# EAGLE design RF-OUT-001 (EAGLE 9.6.2)
DOCNUM: RF-OUT-001; DWBY: Lewis Russell; DWDATE: 3/2/21; DWINIT: LR; REV: 001; TITLE: RF Amplifier Output Filter

## Sheet 1 of 5: System Architecture
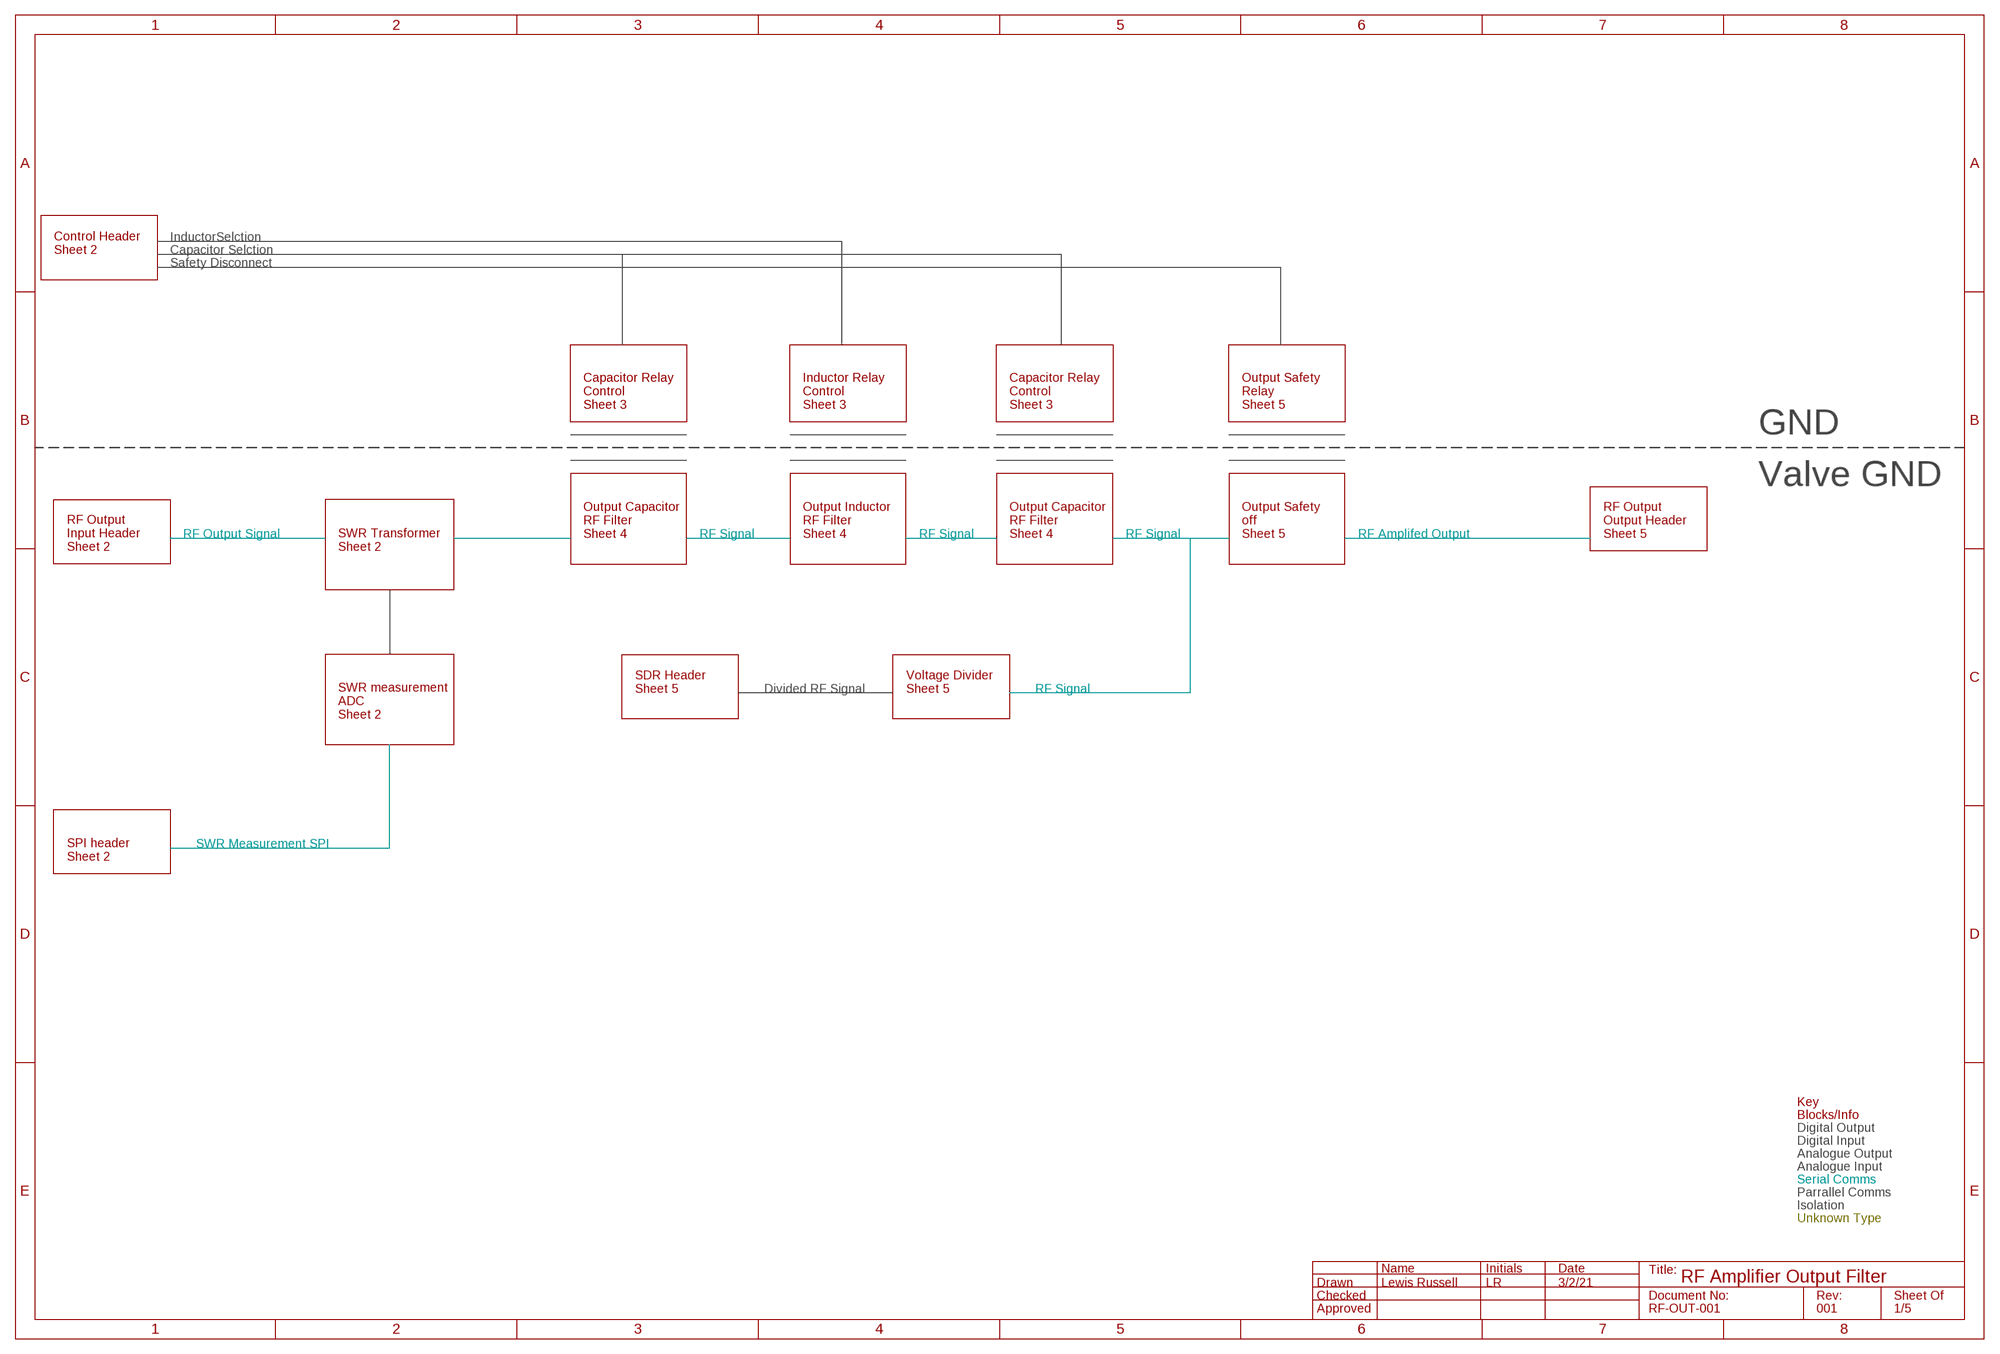
[diagram p0: schematic, sheet 1]

### Notes on the sheet
- InductorSelction
- Control Header
  Sheet 2
- Capacitor Selction
- Safety Disconnect
- Capacitor Relay
  Control
  Sheet 3
- Inductor Relay
  Control
  Sheet 3
- Capacitor Relay
  Control
  Sheet 3
- Output Safety
  Relay
  Sheet 5
- GND
- Valve GND
- RF Output Signal
- Output Capacitor
  RF Filter
  Sheet 4
- RF Signal
- Output Inductor
  RF Filter
  Sheet 4
- RF Signal
- Output Capacitor
  RF Filter
  Sheet 4
- RF Signal
- Output Safety
  off
  Sheet 5
- RF Amplifed Output
- RF Output
  Output Header
  Sheet 5
- RF Output
  Input Header
  Sheet 2
- SWR Transformer
  Sheet 2
- SDR Header
  Sheet 5
- Divided RF Signal
- Voltage Divider
  Sheet 5
- RF Signal
- SWR measurement
  ADC
  Sheet 2
- SWR Measurement SPI
- SPI header
  Sheet 2
- Key
- Blocks/Info
- Digital Output
- Digital Input
- Analogue Output
- Analogue Input
- Serial Comms
- Parrallel Comms
- Isolation
- Unknown Type

## Sheet 2 of 5: SWR Measurement
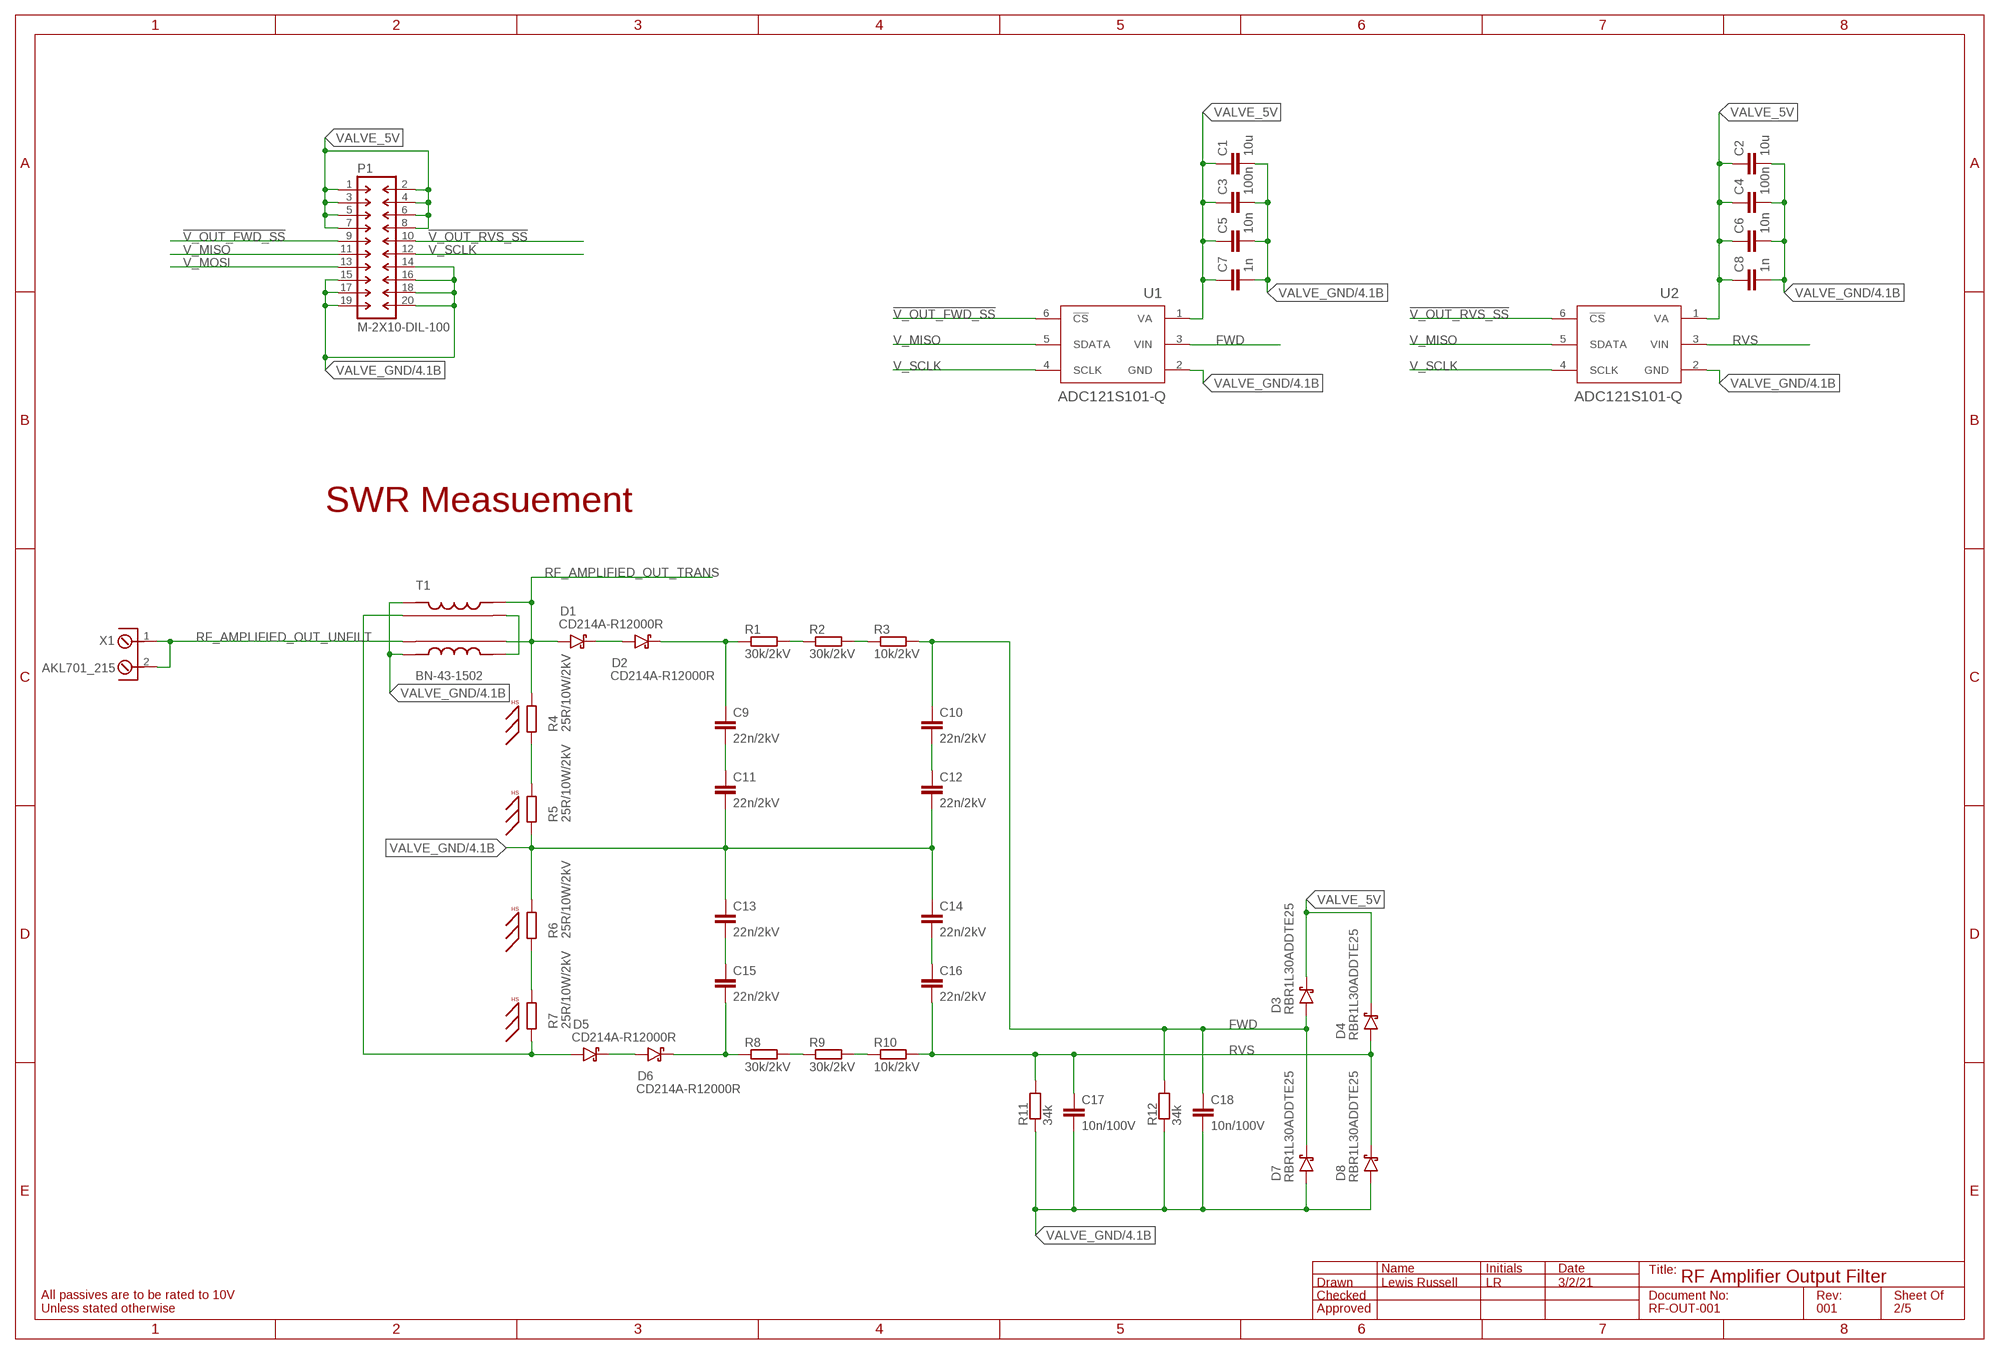
[diagram p1: schematic, sheet 2]

### Parts
C1  10u  C-EUC0805  [C0805]
C2  10u  C-EUC0805  [C0805]
C3  100n  C-EUC0603  [C0603]
C4  100n  C-EUC0603  [C0603]
C5  10n  C-EUC0603  [C0603]
C6  10n  C-EUC0603  [C0603]
C7  1n  C-EUC0603  [C0603]
C8  1n  C-EUC0603  [C0603]
C9  22n/2kV  C-EUC2220K  [C2220K]
C10  22n/2kV  C-EUC2220K  [C2220K]
C11  22n/2kV  C-EUC2220K  [C2220K]
C12  22n/2kV  C-EUC2220K  [C2220K]
C13  22n/2kV  C-EUC2220K  [C2220K]
C14  22n/2kV  C-EUC2220K  [C2220K]
C15  22n/2kV  C-EUC2220K  [C2220K]
C16  22n/2kV  C-EUC2220K  [C2220K]
C17  10n/100V  C-EUC0603  [C0603]
C18  10n/100V  C-EUC0603  [C0603]
D1  CD214A-R12000R  SCHOTTKY_DIODESMB  [SMB/DO-214AA]
D2  CD214A-R12000R  SCHOTTKY_DIODESMB  [SMB/DO-214AA]
D3  RBR1L30ADDTE25  SCHOTTKY_DIODESMA  [SMA/DO-214AC]
D4  RBR1L30ADDTE25  SCHOTTKY_DIODESMA  [SMA/DO-214AC]
D5  CD214A-R12000R  SCHOTTKY_DIODESMB  [SMB/DO-214AA]
D6  CD214A-R12000R  SCHOTTKY_DIODESMB  [SMB/DO-214AA]
D7  RBR1L30ADDTE25  SCHOTTKY_DIODESMA  [SMA/DO-214AC]
D8  RBR1L30ADDTE25  SCHOTTKY_DIODESMA  [SMA/DO-214AC]
P1  M-2X10-DIL-100  [DIL-100-2X10]
R1  30k/2kV  R-EU_0309/10  [0309/10]
R2  30k/2kV  R-EU_0309/10  [0309/10]
R3  10k/2kV  R-EU_0309/10  [0309/10]
R4  25R/10W/2kV  R-EU_W_HS_TO-220-WV-T220-101E  [TO220ACS_WITH_WV-T220-101E]
R5  25R/10W/2kV  R-EU_W_HS_TO-220-WV-T220-101E  [TO220ACS_WITH_WV-T220-101E]
R6  25R/10W/2kV  R-EU_W_HS_TO-220-WV-T220-101E  [TO220ACS_WITH_WV-T220-101E]
R7  25R/10W/2kV  R-EU_W_HS_TO-220-WV-T220-101E  [TO220ACS_WITH_WV-T220-101E]
R8  30k/2kV  R-EU_0309/10  [0309/10]
R9  30k/2kV  R-EU_0309/10  [0309/10]
R10  10k/2kV  R-EU_0309/10  [0309/10]
R11  34k  R-EUR0603  [R0603]
R12  34k  R-EUR0603  [R0603]
T1  BN-43-1502  [BN-43-1502]
U1  ADC121S101-Q  [SOT23-6]
U2  ADC121S101-Q  [SOT23-6]
X1  AKL701_215  [AKL701_2_15]

### Nets
!V_OUT_FWD_SS [HV_SIG]: P1.9 U1.6(!CS)
!V_OUT_RVS_SS [HV_SIG]: P1.10 U2.6(!CS)
FWD [HV_SIG]: C10.1 C18.1 D3.A(ANODE) D7.C(CATHODE) R3.2 R12.2 U1.3(VIN)
N$196 [HV_RF]: T1.L2-2(C2-2) T1.T1-2(L1-2)
N$198 [HV DIV]: R4.1 R5.2
N$199 [HV_RDIV]: R6.1 R7.2
N$200 [HV_SIG]: C9.2 C11.1
N$201 [HV DIV]: D1.C(CATHODE) D2.A(ANODE)
N$203 [HV_SIG]: C9.1 D2.C(CATHODE) R1.1
N$204 [HV_SIG]: R1.2 R2.1
N$205 [HV_SIG]: C10.2 C12.1
N$207 [HV_SIG]: R2.2 R3.1
N$209 [HV_SIG]: C13.2 C15.1
N$210 [HV DIV]: D5.C(CATHODE) D6.A(ANODE)
N$211 [HV_SIG]: C15.2 D6.C(CATHODE) R8.1
N$212 [HV_SIG]: C14.2 C16.1
N$214 [HV_SIG]: R8.2 R9.1
N$215 [HV_SIG]: R9.2 R10.1
N$216 [HV_RF]: D5.A(ANODE) R7.1 T1.T1-1(L1-1)
RF_AMPLIFIED_OUT_TRANS [HV_RF]: D1.A(ANODE) R4.2 T1.L1-2(C1-2) T1.T2-2(L2-2) ; also sheet 4
RF_AMPLIFIED_OUT_UNFILT [HV_RF]: T1.T2-1(L2-1) X1.1 X1.2
RVS [HV_SIG]: C16.2 C17.1 D4.A(ANODE) D8.C(CATHODE) R10.2 R11.2 U2.3(VIN)
V_MISO [HV_SIG]: P1.11 U1.5(SDATA) U2.5(SDATA)
V_MOSI [HV_SIG]: P1.13
V_SCLK [HV_SIG]: P1.12 U1.4(SCLK) U2.4(SCLK)
VALVE_5V [HV_GND]: C1.1 C2.1 C3.1 C4.1 C5.1 C6.1 C7.1 C8.1 D3.C(CATHODE) D4.C(CATHODE) P1.1 P1.2 P1.3 P1.4 P1.5 P1.6 P1.7 P1.8 U1.1(VA) U2.1(VA)
VALVE_GND [HV_GND]: C1.2 C2.2 C3.2 C4.2 C5.2 C6.2 C7.2 C8.2 C11.2 C12.2 C13.1 C14.1 C17.2 C18.2 D7.A(ANODE) D8.A(ANODE) P1.14 P1.15 P1.16 P1.17 P1.18 P1.19 P1.20 R5.1 R6.2 R11.1 R12.1 T1.L1-1(C1-1) T1.L2-1(C2-1) U1.2(GND) U2.2(GND) ; also sheet 4,5

### Notes on the sheet
- SWR Measuement
- All passives are to be rated to 10V
  Unless stated otherwise

## Sheet 3 of 5: ATU Relay Control
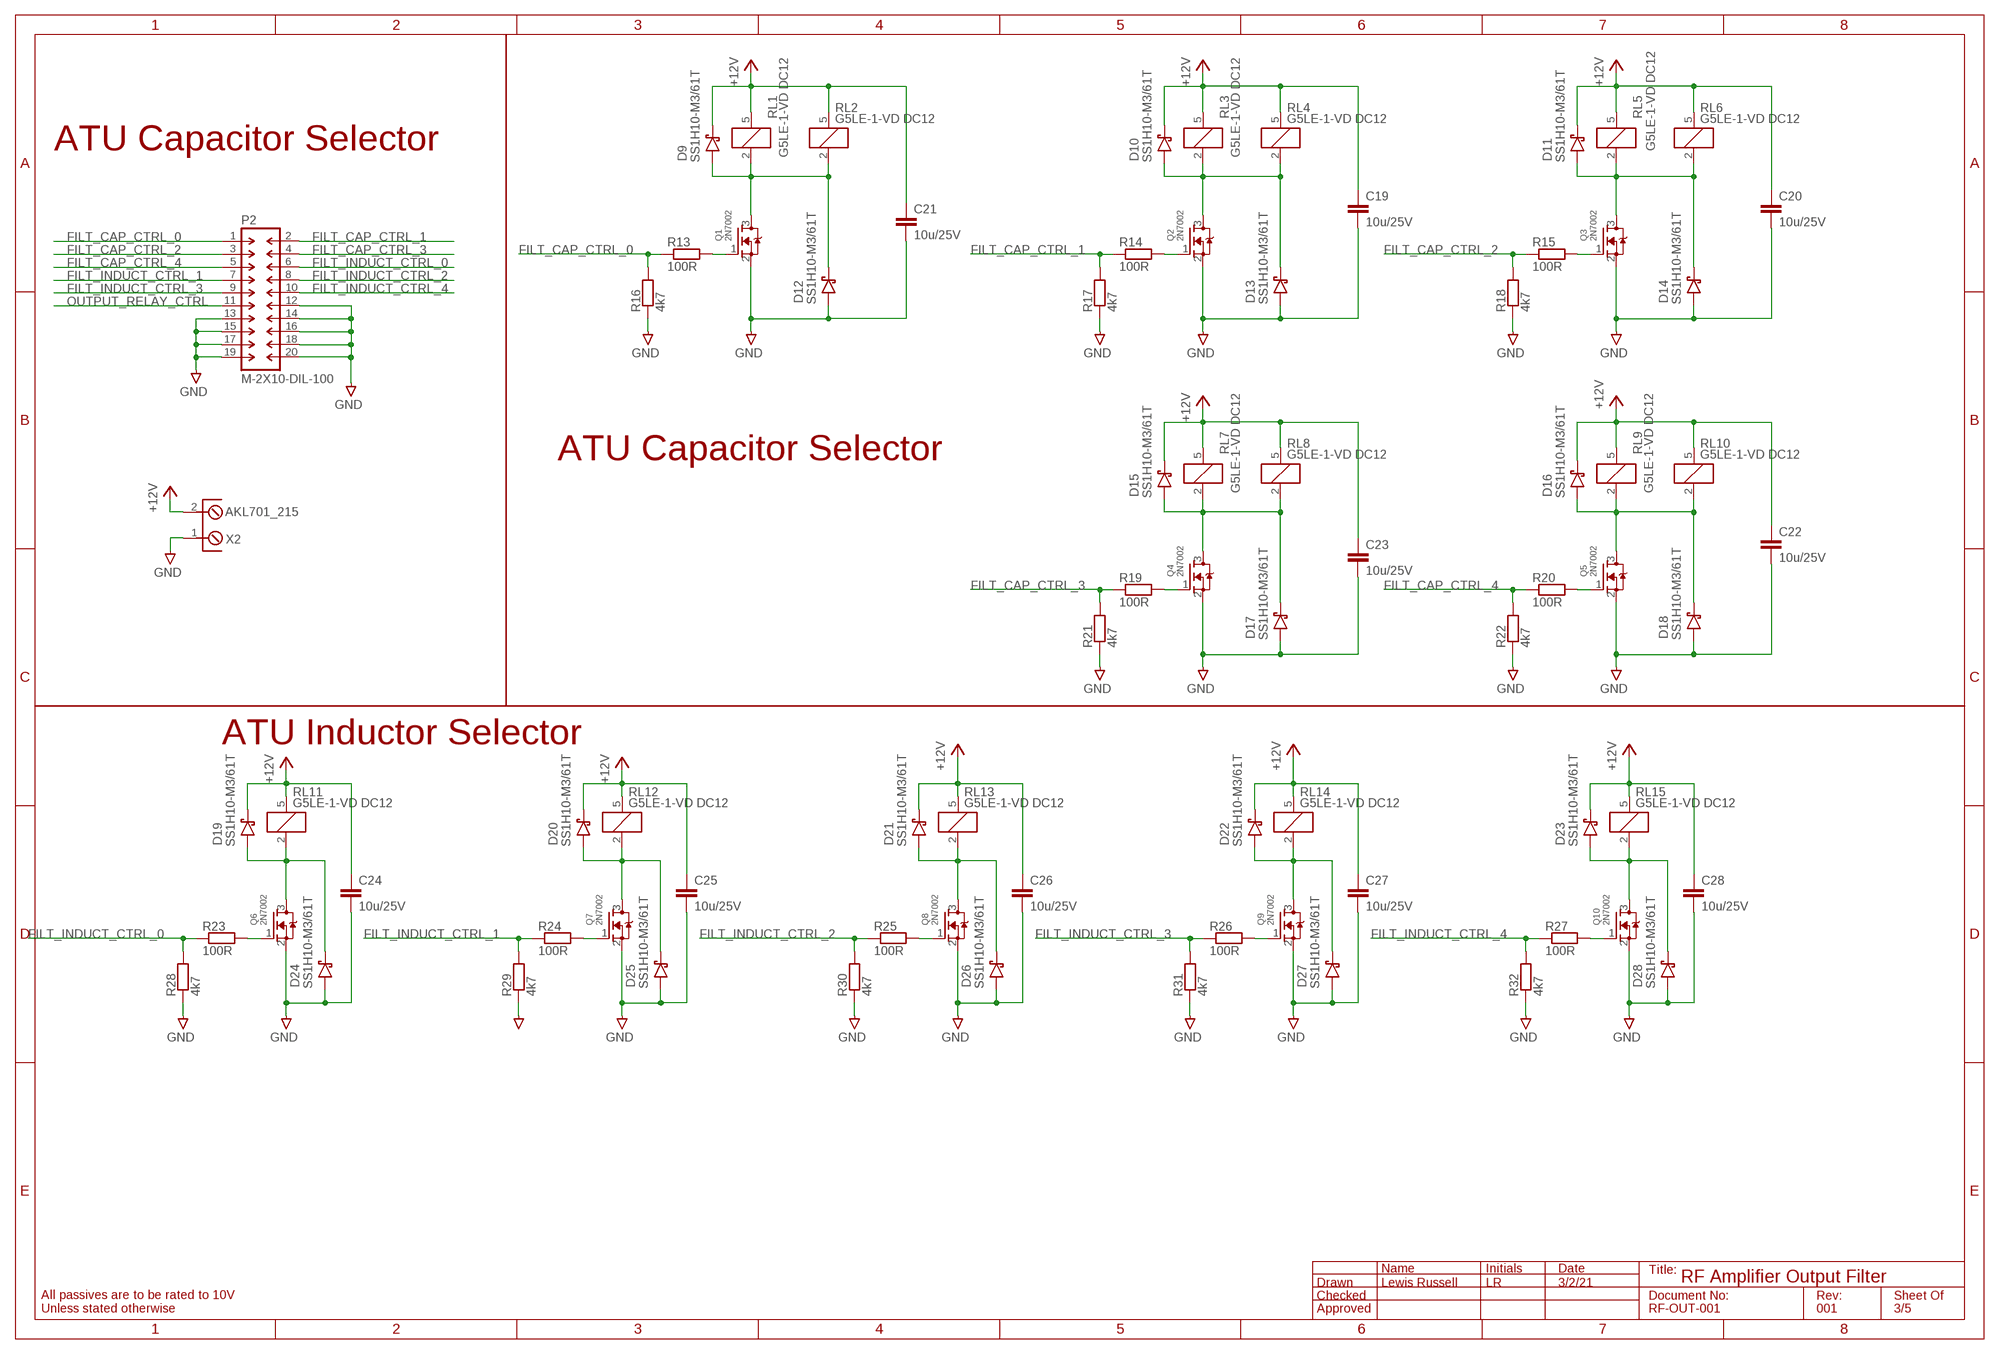
[diagram p2: schematic, sheet 3]

### Parts
C19  10u/25V  C-EUC0805  [C0805]
C20  10u/25V  C-EUC0805  [C0805]
C21  10u/25V  C-EUC0805  [C0805]
C22  10u/25V  C-EUC0805  [C0805]
C23  10u/25V  C-EUC0805  [C0805]
C24  10u/25V  C-EUC0805  [C0805]
C25  10u/25V  C-EUC0805  [C0805]
C26  10u/25V  C-EUC0805  [C0805]
C27  10u/25V  C-EUC0805  [C0805]
C28  10u/25V  C-EUC0805  [C0805]
D9  SS1H10-M3/61T  SCHOTTKY_DIODESMA  [SMA/DO-214AC]
D10  SS1H10-M3/61T  SCHOTTKY_DIODESMA  [SMA/DO-214AC]
D11  SS1H10-M3/61T  SCHOTTKY_DIODESMA  [SMA/DO-214AC]
D12  SS1H10-M3/61T  SCHOTTKY_DIODESMA  [SMA/DO-214AC]
D13  SS1H10-M3/61T  SCHOTTKY_DIODESMA  [SMA/DO-214AC]
D14  SS1H10-M3/61T  SCHOTTKY_DIODESMA  [SMA/DO-214AC]
D15  SS1H10-M3/61T  SCHOTTKY_DIODESMA  [SMA/DO-214AC]
D16  SS1H10-M3/61T  SCHOTTKY_DIODESMA  [SMA/DO-214AC]
D17  SS1H10-M3/61T  SCHOTTKY_DIODESMA  [SMA/DO-214AC]
D18  SS1H10-M3/61T  SCHOTTKY_DIODESMA  [SMA/DO-214AC]
D19  SS1H10-M3/61T  SCHOTTKY_DIODESMA  [SMA/DO-214AC]
D20  SS1H10-M3/61T  SCHOTTKY_DIODESMA  [SMA/DO-214AC]
D21  SS1H10-M3/61T  SCHOTTKY_DIODESMA  [SMA/DO-214AC]
D22  SS1H10-M3/61T  SCHOTTKY_DIODESMA  [SMA/DO-214AC]
D23  SS1H10-M3/61T  SCHOTTKY_DIODESMA  [SMA/DO-214AC]
D24  SS1H10-M3/61T  SCHOTTKY_DIODESMA  [SMA/DO-214AC]
D25  SS1H10-M3/61T  SCHOTTKY_DIODESMA  [SMA/DO-214AC]
D26  SS1H10-M3/61T  SCHOTTKY_DIODESMA  [SMA/DO-214AC]
D27  SS1H10-M3/61T  SCHOTTKY_DIODESMA  [SMA/DO-214AC]
D28  SS1H10-M3/61T  SCHOTTKY_DIODESMA  [SMA/DO-214AC]
P2  M-2X10-DIL-100  [DIL-100-2X10]
Q1  2N7002  MOSFET-NREFLOW  [SOT23]
Q2  2N7002  MOSFET-NREFLOW  [SOT23]
Q3  2N7002  MOSFET-NREFLOW  [SOT23]
Q4  2N7002  MOSFET-NREFLOW  [SOT23]
Q5  2N7002  MOSFET-NREFLOW  [SOT23]
Q6  2N7002  MOSFET-NREFLOW  [SOT23]
Q7  2N7002  MOSFET-NREFLOW  [SOT23]
Q8  2N7002  MOSFET-NREFLOW  [SOT23]
Q9  2N7002  MOSFET-NREFLOW  [SOT23]
Q10  2N7002  MOSFET-NREFLOW  [SOT23]
R13  100R  R-EUR0603  [R0603]
R14  100R  R-EUR0603  [R0603]
R15  100R  R-EUR0603  [R0603]
R16  4k7  R-EUR0603  [R0603]
R17  4k7  R-EUR0603  [R0603]
R18  4k7  R-EUR0603  [R0603]
R19  100R  R-EUR0603  [R0603]
R20  100R  R-EUR0603  [R0603]
R21  4k7  R-EUR0603  [R0603]
R22  4k7  R-EUR0603  [R0603]
R23  100R  R-EUR0603  [R0603]
R24  100R  R-EUR0603  [R0603]
R25  100R  R-EUR0603  [R0603]
R26  100R  R-EUR0603  [R0603]
R27  100R  R-EUR0603  [R0603]
R28  4k7  R-EUR0603  [R0603]
R29  4k7  R-EUR0603  [R0603]
R30  4k7  R-EUR0603  [R0603]
R31  4k7  R-EUR0603  [R0603]
R32  4k7  R-EUR0603  [R0603]
RL1  G5LE-1-VD DC12  G5LE-E  [SPDT]
RL2  G5LE-1-VD DC12  G5LE-E  [SPDT]
RL3  G5LE-1-VD DC12  G5LE-E  [SPDT]
RL4  G5LE-1-VD DC12  G5LE-E  [SPDT]
RL5  G5LE-1-VD DC12  G5LE-E  [SPDT]
RL6  G5LE-1-VD DC12  G5LE-E  [SPDT]
RL7  G5LE-1-VD DC12  G5LE-E  [SPDT]
RL8  G5LE-1-VD DC12  G5LE-E  [SPDT]
RL9  G5LE-1-VD DC12  G5LE-E  [SPDT]
RL10  G5LE-1-VD DC12  G5LE-E  [SPDT]
RL11  G5LE-1-VD DC12  G5LE-E  [SPDT]
RL12  G5LE-1-VD DC12  G5LE-E  [SPDT]
RL13  G5LE-1-VD DC12  G5LE-E  [SPDT]
RL14  G5LE-1-VD DC12  G5LE-E  [SPDT]
RL15  G5LE-1-VD DC12  G5LE-E  [SPDT]
X2  AKL701_215  [AKL701_2_15]

### Nets
+12V [GND Signal]: C19.1 C20.1 C21.1 C22.1 C23.1 C24.1 C25.1 C26.1 C27.1 C28.1 D9.C(CATHODE) D10.C(CATHODE) D11.C(CATHODE) D15.C(CATHODE) D16.C(CATHODE) D19.C(CATHODE) D20.C(CATHODE) D21.C(CATHODE) D22.C(CATHODE) D23.C(CATHODE) RL1.5 RL2.5 RL3.5 RL4.5 RL5.5 RL6.5 RL7.5 RL8.5 RL9.5 RL10.5 RL11.5 RL12.5 RL13.5 RL14.5 RL15.5 X2.2 ; also sheet 5
FILT_CAP_CTRL_0 [GND Signal]: P2.1 R13.1 R16.2
FILT_CAP_CTRL_1 [GND Signal]: P2.2 R14.1 R17.2
FILT_CAP_CTRL_2 [GND Signal]: P2.3 R15.1 R18.2
FILT_CAP_CTRL_3 [GND Signal]: P2.4 R19.1 R21.2
FILT_CAP_CTRL_4 [GND Signal]: P2.5 R20.1 R22.2
FILT_INDUCT_CTRL_0 [GND Signal]: P2.6 R23.1 R28.2
FILT_INDUCT_CTRL_1 [GND Signal]: P2.7 R24.1 R29.2
FILT_INDUCT_CTRL_2 [GND Signal]: P2.8 R25.1 R30.2
FILT_INDUCT_CTRL_3 [GND Signal]: P2.9 R26.1 R31.2
FILT_INDUCT_CTRL_4 [GND Signal]: P2.10 R27.1 R32.2
GND [GND Signal]: C19.2 C20.2 C21.2 C22.2 C23.2 C24.2 C25.2 C26.2 C27.2 C28.2 D12.A(ANODE) D13.A(ANODE) D14.A(ANODE) D17.A(ANODE) D18.A(ANODE) D24.A(ANODE) D25.A(ANODE) D26.A(ANODE) D27.A(ANODE) D28.A(ANODE) P2.12 P2.13 P2.14 P2.15 P2.16 P2.17 P2.18 P2.19 P2.20 Q1.2(S) Q2.2(S) Q3.2(S) Q4.2(S) Q5.2(S) Q6.2(S) Q7.2(S) Q8.2(S) Q9.2(S) Q10.2(S) R16.1 R17.1 R18.1 R21.1 R22.1 R28.1 R29.1 R30.1 R31.1 R32.1 X2.1 ; also sheet 5
N$150 [GND Signal]: D9.A(ANODE) D12.C(CATHODE) Q1.3(D) RL1.2 RL2.2
N$162 [GND Signal]: Q1.1(G) R13.2
N$163 [GND Signal]: D10.A(ANODE) D13.C(CATHODE) Q2.3(D) RL3.2 RL4.2
N$175 [GND Signal]: Q2.1(G) R14.2
N$176 [GND Signal]: D11.A(ANODE) D14.C(CATHODE) Q3.3(D) RL5.2 RL6.2
N$301 [GND Signal]: Q3.1(G) R15.2
N$303 [GND Signal]: D15.A(ANODE) D17.C(CATHODE) Q4.3(D) RL7.2 RL8.2
N$305 [GND Signal]: Q4.1(G) R19.2
N$306 [GND Signal]: D16.A(ANODE) D18.C(CATHODE) Q5.3(D) RL9.2 RL10.2
N$307 [GND Signal]: Q5.1(G) R20.2
N$312 [GND Signal]: D19.A(ANODE) D24.C(CATHODE) Q6.3(D) RL11.2
N$314 [GND Signal]: Q6.1(G) R23.2
N$315 [GND Signal]: D20.A(ANODE) D25.C(CATHODE) Q7.3(D) RL12.2
N$316 [GND Signal]: Q7.1(G) R24.2
N$317 [GND Signal]: D21.A(ANODE) D26.C(CATHODE) Q8.3(D) RL13.2
N$318 [GND Signal]: Q8.1(G) R25.2
N$323 [GND Signal]: D22.A(ANODE) D27.C(CATHODE) Q9.3(D) RL14.2
N$324 [GND Signal]: Q9.1(G) R26.2
N$325 [GND Signal]: D23.A(ANODE) D28.C(CATHODE) Q10.3(D) RL15.2
N$326 [GND Signal]: Q10.1(G) R27.2
OUTPUT_RELAY_CTRL [GND Signal]: P2.11 ; also sheet 5

### Notes on the sheet
- ATU Capacitor Selector
- ATU Capacitor Selector
- ATU Inductor Selector
- All passives are to be rated to 10V
  Unless stated otherwise

## Sheet 4 of 5: ATU LC Filter
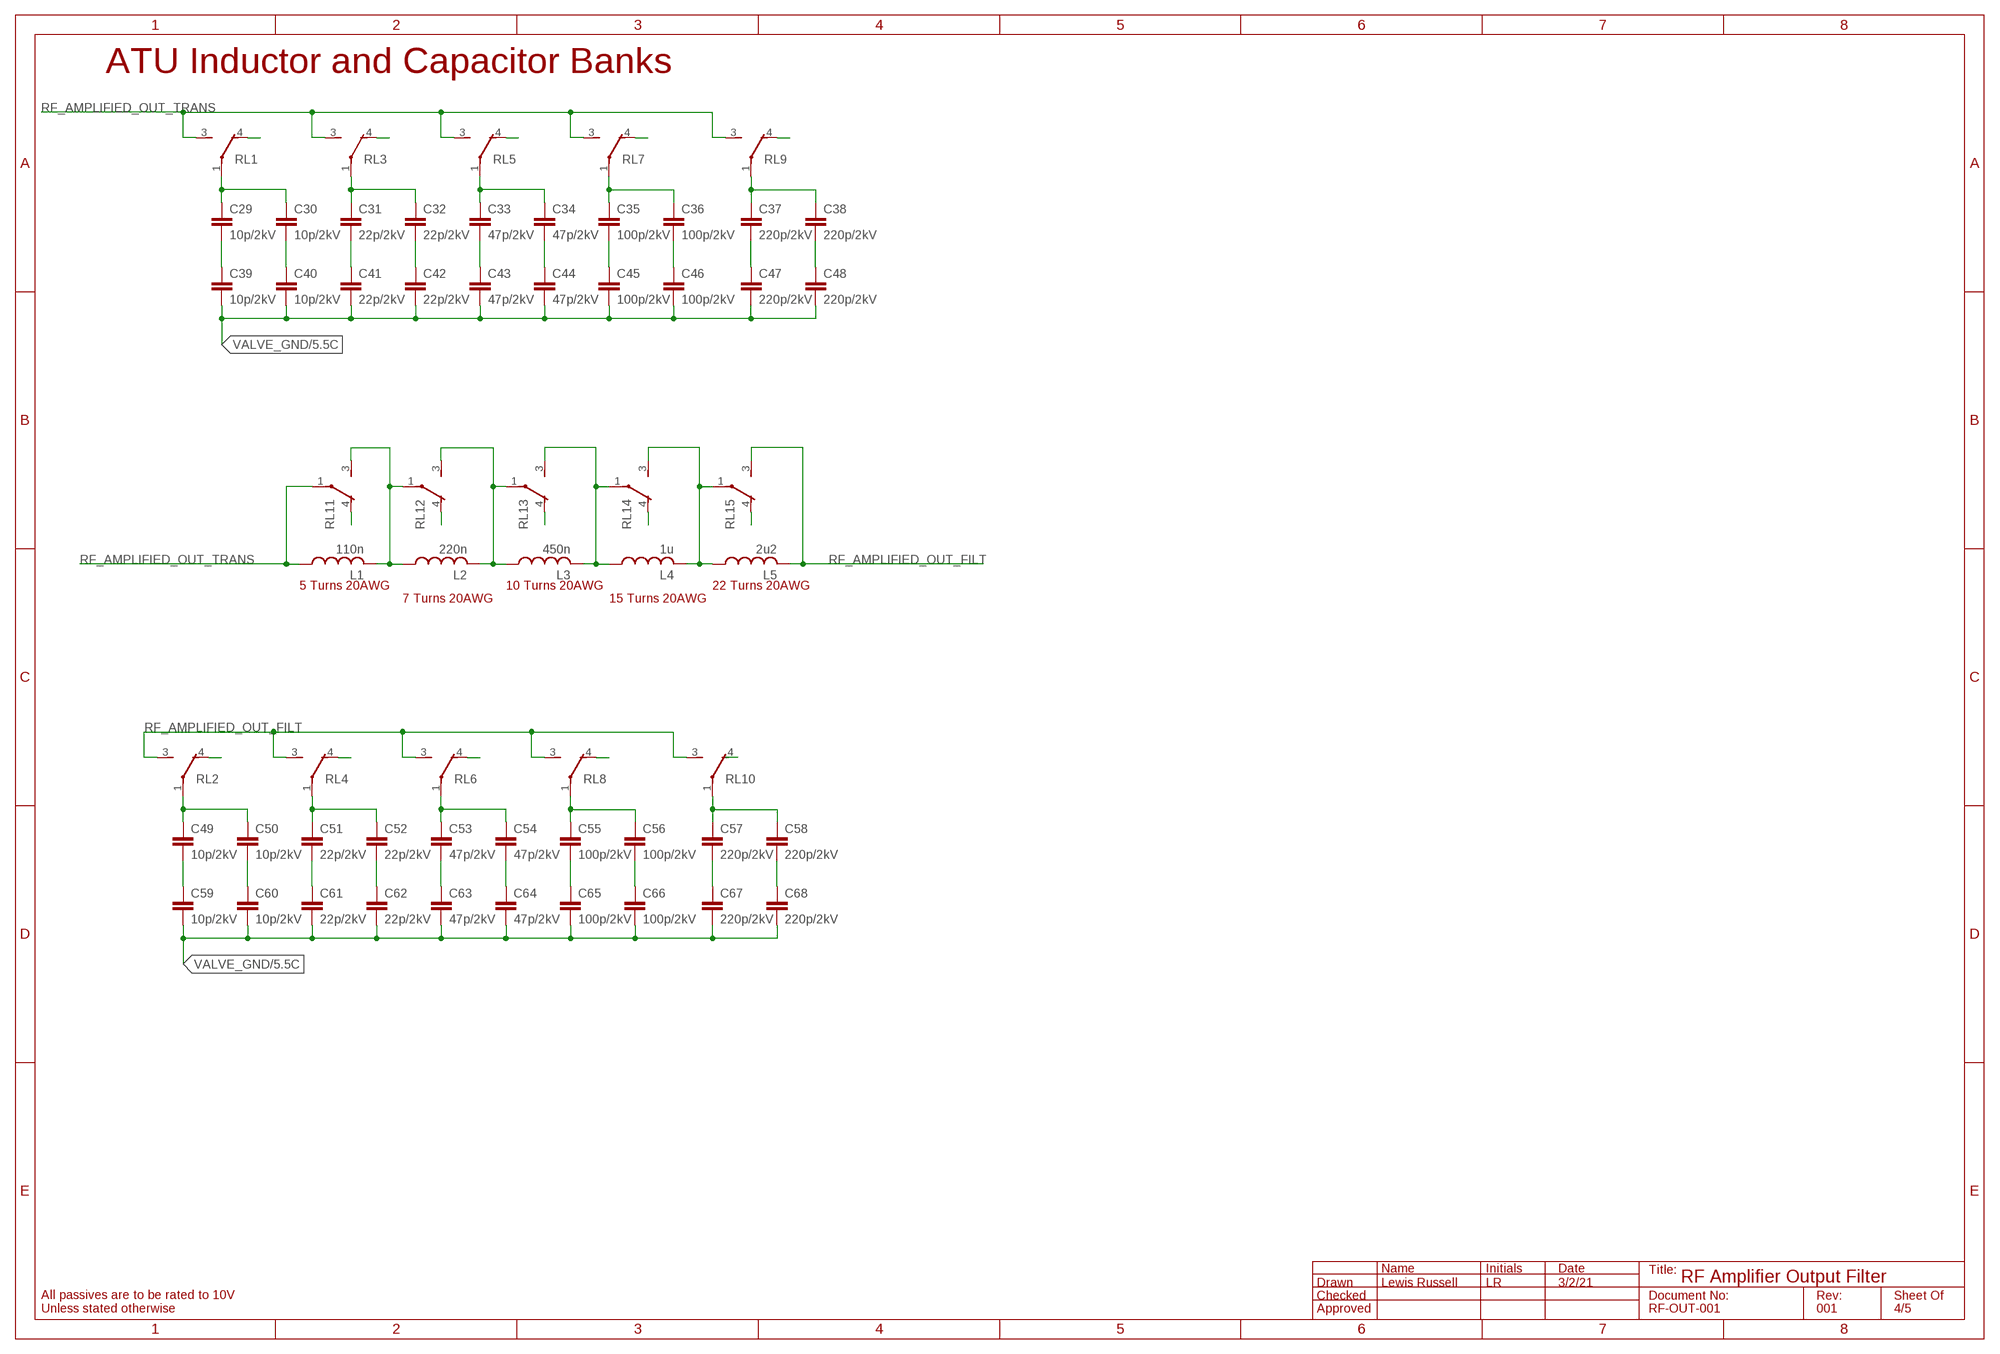
[diagram p3: schematic, sheet 4]

### Parts
C29  10p/2kV  C-EU050-055X075  [C050-055X075]
C30  10p/2kV  C-EU050-055X075  [C050-055X075]
C31  22p/2kV  C-EU050-055X075  [C050-055X075]
C32  22p/2kV  C-EU050-055X075  [C050-055X075]
C33  47p/2kV  C-EU050-055X075  [C050-055X075]
C34  47p/2kV  C-EU050-055X075  [C050-055X075]
C35  100p/2kV  C-EU050-075X075  [C050-075X075]
C36  100p/2kV  C-EU050-075X075  [C050-075X075]
C37  220p/2kV  C-EU050-075X075  [C050-075X075]
C38  220p/2kV  C-EU050-075X075  [C050-075X075]
C39  10p/2kV  C-EU050-055X075  [C050-055X075]
C40  10p/2kV  C-EU050-055X075  [C050-055X075]
C41  22p/2kV  C-EU050-055X075  [C050-055X075]
C42  22p/2kV  C-EU050-055X075  [C050-055X075]
C43  47p/2kV  C-EU050-055X075  [C050-055X075]
C44  47p/2kV  C-EU050-055X075  [C050-055X075]
C45  100p/2kV  C-EU050-075X075  [C050-075X075]
C46  100p/2kV  C-EU050-075X075  [C050-075X075]
C47  220p/2kV  C-EU050-075X075  [C050-075X075]
C48  220p/2kV  C-EU050-075X075  [C050-075X075]
C49  10p/2kV  C-EU050-055X075  [C050-055X075]
C50  10p/2kV  C-EU050-055X075  [C050-055X075]
C51  22p/2kV  C-EU050-055X075  [C050-055X075]
C52  22p/2kV  C-EU050-055X075  [C050-055X075]
C53  47p/2kV  C-EU050-055X075  [C050-055X075]
C54  47p/2kV  C-EU050-055X075  [C050-055X075]
C55  100p/2kV  C-EU050-075X075  [C050-075X075]
C56  100p/2kV  C-EU050-075X075  [C050-075X075]
C57  220p/2kV  C-EU050-075X075  [C050-075X075]
C58  220p/2kV  C-EU050-075X075  [C050-075X075]
C59  10p/2kV  C-EU050-055X075  [C050-055X075]
C60  10p/2kV  C-EU050-055X075  [C050-055X075]
C61  22p/2kV  C-EU050-055X075  [C050-055X075]
C62  22p/2kV  C-EU050-055X075  [C050-055X075]
C63  47p/2kV  C-EU050-055X075  [C050-055X075]
C64  47p/2kV  C-EU050-055X075  [C050-055X075]
C65  100p/2kV  C-EU050-075X075  [C050-075X075]
C66  100p/2kV  C-EU050-075X075  [C050-075X075]
C67  220p/2kV  C-EU050-075X075  [C050-075X075]
C68  220p/2kV  C-EU050-075X075  [C050-075X075]
L1  110n  T80-6  [T80-6]
L2  220n  T80-6  [T80-6]
L3  450n  T80-6  [T80-6]
L4  1u  T80-6  [T80-6]
L5  2u2  T80-6  [T80-6]

### Nets
N$1 [HV_RF]: RL1.4
N$2 [HV_RF]: RL3.4
N$3 [HV_RF]: RL5.4
N$4 [HV_RF]: RL7.4
N$5 [HV_RF]: RL9.4
N$6 [HV_RF]: C29.1 C30.1 RL1.1
N$7 [HV_RF]: C37.1 C38.1 RL9.1
N$8 [HV_RF]: RL11.4
N$9 [HV_RF]: RL12.4
N$10 [HV_RF]: RL13.4
N$11 [HV_RF]: RL14.4
N$12 [HV_RF]: RL15.4
N$13 [HV_RF]: C49.1 C50.1 RL2.1
N$14 [HV_RF]: C51.1 C52.1 RL4.1
N$15 [HV_RF]: RL2.4
N$16 [HV_RF]: RL4.4
N$17 [HV_RF]: RL6.4
N$18 [HV_RF]: RL8.4
N$19 [HV_RF]: RL10.4
N$20 [HV_RF]: C53.1 C54.1 RL6.1
N$21 [HV_RF]: C55.1 C56.1 RL8.1
N$22 [HV_RF]: C29.2 C39.1
N$24 [HV_RF]: C32.2 C42.1
N$25 [HV_RF]: C30.2 C40.1
N$26 [HV_RF]: C34.2 C44.1
N$27 [HV_RF]: C36.2 C46.1
N$28 [HV_RF]: C38.2 C48.1
N$29 [HV_RF]: C31.2 C41.1
N$30 [HV_RF]: C33.2 C43.1
N$31 [HV_RF]: C35.2 C45.1
N$32 [HV_RF]: C37.2 C47.1
N$33 [HV_RF]: C57.1 C58.1 RL10.1
N$35 [HV_RF]: C52.2 C62.1
N$36 [HV_RF]: C50.2 C60.1
N$37 [HV_RF]: C54.2 C64.1
N$38 [HV_RF]: C56.2 C66.1
N$39 [HV_RF]: C58.2 C68.1
N$40 [HV_RF]: C49.2 C59.1
N$41 [HV_RF]: C51.2 C61.1
N$42 [HV_RF]: C53.2 C63.1
N$43 [HV_RF]: C55.2 C65.1
N$44 [HV_RF]: C57.2 C67.1
N$249 [HV_RF]: C33.1 C34.1 RL5.1
N$251 [HV_RF]: C35.1 C36.1 RL7.1
N$252 [HV_RF]: C31.1 C32.1 RL3.1
N$338 [HV_RF]: L4.2 L5.1 RL14.3 RL15.1
N$339 [HV_RF]: L3.2 L4.1 RL13.3 RL14.1
N$340 [HV_RF]: L2.2 L3.1 RL12.3 RL13.1
N$341 [HV_RF]: L1.2 L2.1 RL11.3 RL12.1
RF_AMPLIFIED_OUT_FILT [HV_RF]: L5.2 RL2.3 RL4.3 RL6.3 RL8.3 RL10.3 RL15.3 ; also sheet 5
RF_AMPLIFIED_OUT_TRANS [HV_RF]: L1.1 RL1.3 RL3.3 RL5.3 RL7.3 RL9.3 RL11.1 ; also sheet 2
VALVE_GND [HV_GND]: C39.2 C40.2 C41.2 C42.2 C43.2 C44.2 C45.2 C46.2 C47.2 C48.2 C59.2 C60.2 C61.2 C62.2 C63.2 C64.2 C65.2 C66.2 C67.2 C68.2 ; also sheet 2,5

### Notes on the sheet
- ATU Inductor and Capacitor Banks
- 5 Turns 20AWG | 10 Turns 20AWG | 22 Turns 20AWG
- 7 Turns 20AWG | 15 Turns 20AWG
- All passives are to be rated to 10V
  Unless stated otherwise

## Sheet 5 of 5: Output Stage
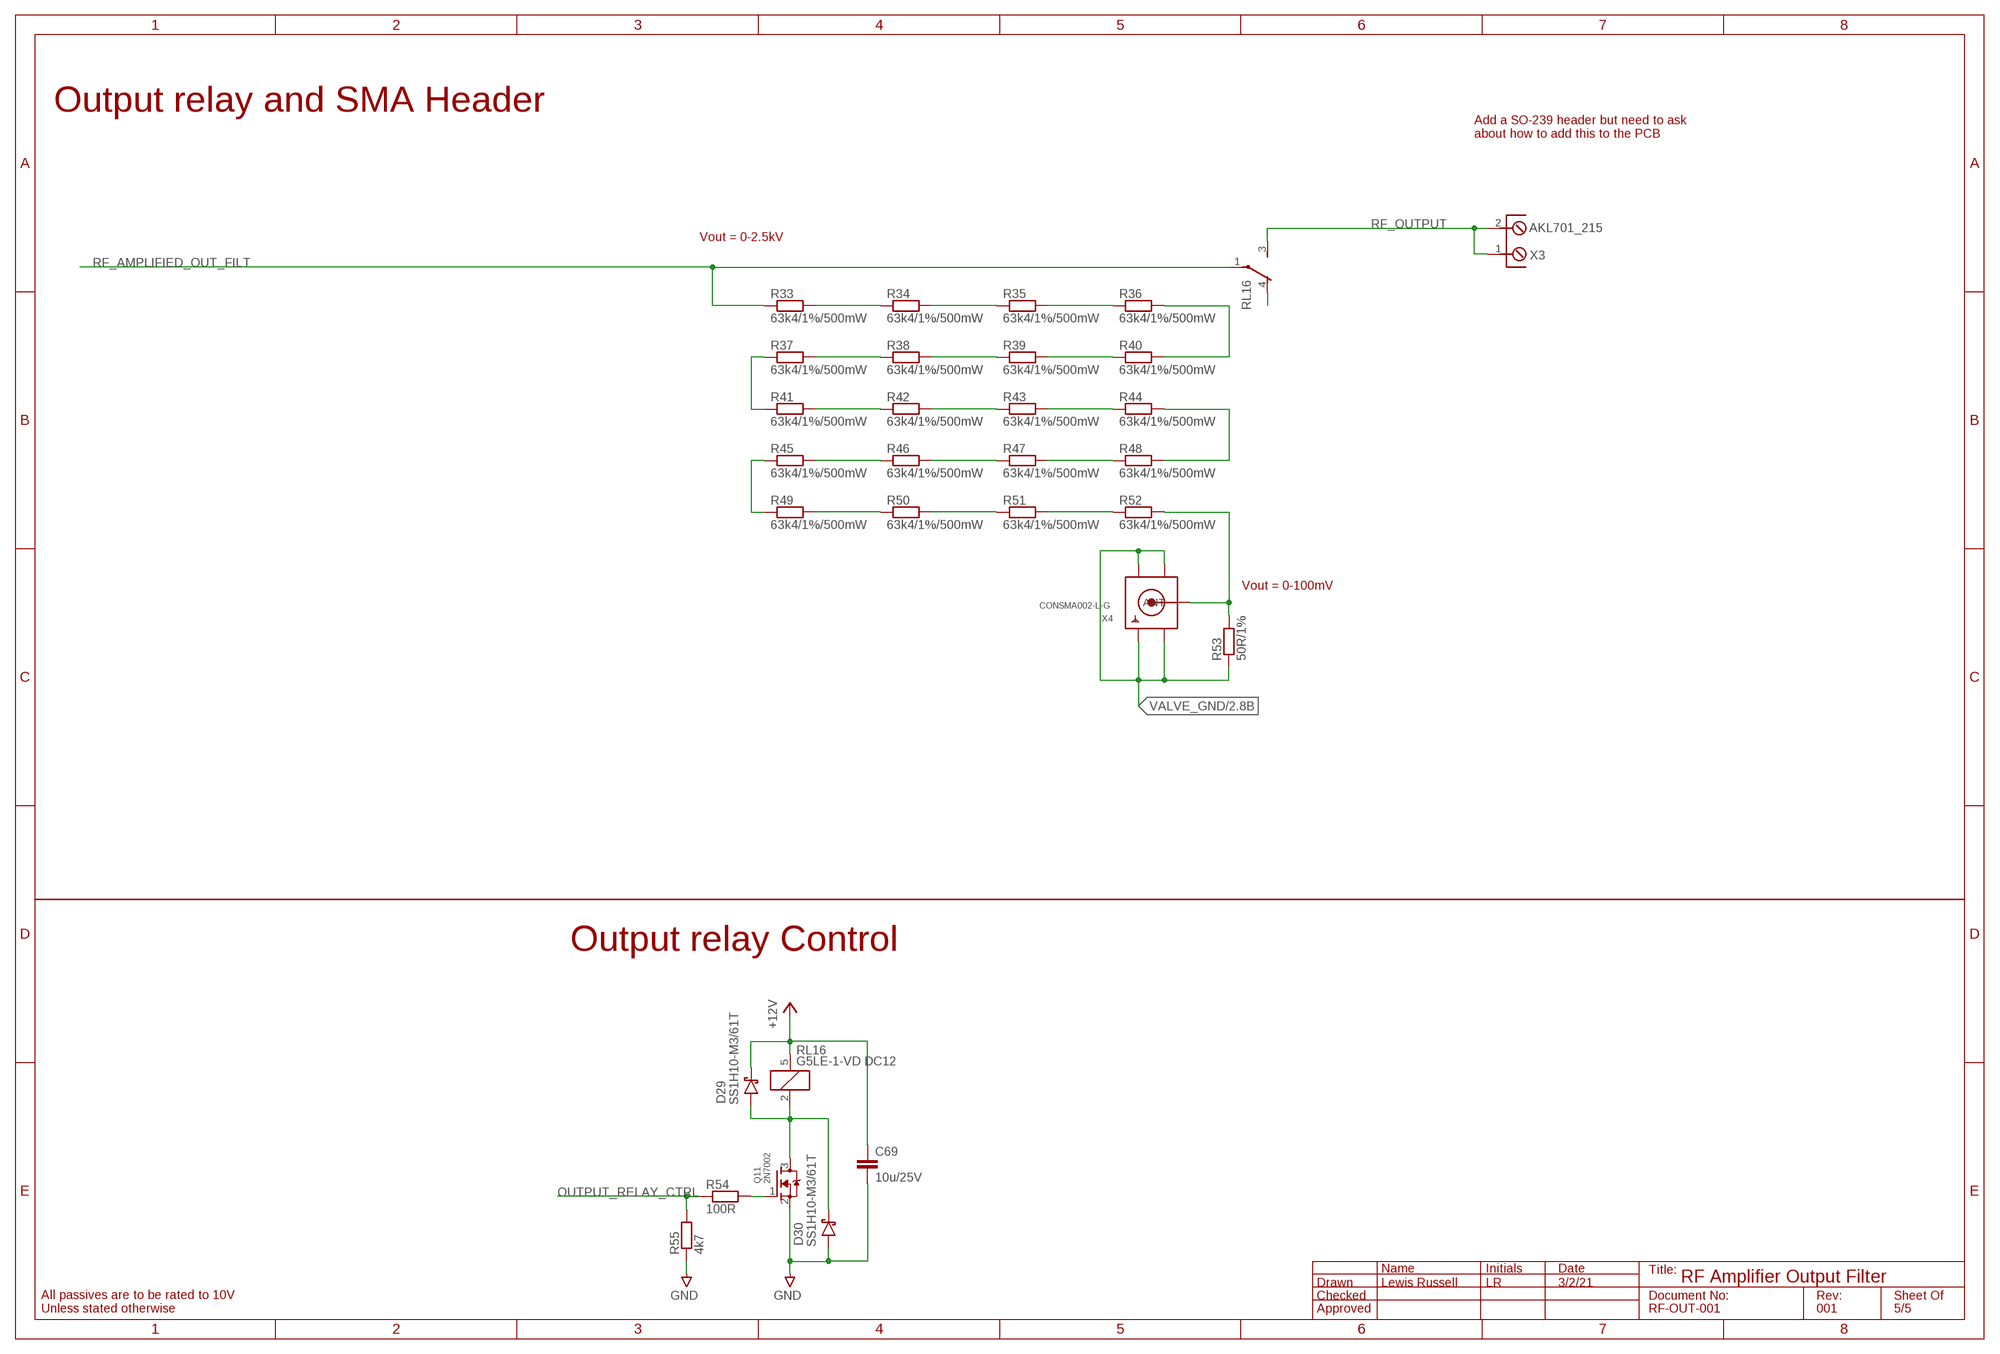
[diagram p4: schematic, sheet 5]

### Parts
C69  10u/25V  C-EUC0805  [C0805]
D29  SS1H10-M3/61T  SCHOTTKY_DIODESMA  [SMA/DO-214AC]
D30  SS1H10-M3/61T  SCHOTTKY_DIODESMA  [SMA/DO-214AC]
Q11  2N7002  MOSFET-NREFLOW  [SOT23]
R33  63k4/1%/500mW  R-EUR0805  [R0805]
R34  63k4/1%/500mW  R-EUR0805  [R0805]
R35  63k4/1%/500mW  R-EUR0805  [R0805]
R36  63k4/1%/500mW  R-EUR0805  [R0805]
R37  63k4/1%/500mW  R-EUR0805  [R0805]
R38  63k4/1%/500mW  R-EUR0805  [R0805]
R39  63k4/1%/500mW  R-EUR0805  [R0805]
R40  63k4/1%/500mW  R-EUR0805  [R0805]
R41  63k4/1%/500mW  R-EUR0805  [R0805]
R42  63k4/1%/500mW  R-EUR0805  [R0805]
R43  63k4/1%/500mW  R-EUR0805  [R0805]
R44  63k4/1%/500mW  R-EUR0805  [R0805]
R45  63k4/1%/500mW  R-EUR0805  [R0805]
R46  63k4/1%/500mW  R-EUR0805  [R0805]
R47  63k4/1%/500mW  R-EUR0805  [R0805]
R48  63k4/1%/500mW  R-EUR0805  [R0805]
R49  63k4/1%/500mW  R-EUR0805  [R0805]
R50  63k4/1%/500mW  R-EUR0805  [R0805]
R51  63k4/1%/500mW  R-EUR0805  [R0805]
R52  63k4/1%/500mW  R-EUR0805  [R0805]
R53  50R/1%  R-EUR0603  [R0603]
R54  100R  R-EUR0603  [R0603]
R55  4k7  R-EUR0603  [R0603]
RL16  G5LE-1-VD DC12  G5LE-E  [SPDT]
X3  AKL701_215  [AKL701_2_15]
X4  CONSMA002-L-G  SMACONNECTOR  [SMA90_DIP]

### Nets
+12V [GND Signal]: C69.1 D29.C(CATHODE) RL16.5 ; also sheet 3
GND [GND Signal]: C69.2 D30.A(ANODE) Q11.2(S) R55.1 ; also sheet 3
N$23 [HV_RF]: RL16.4
N$34 [HV_SIG]: R52.2 R53.2 X4.ANTENNA(ANT)
N$123 [HV_RDIV]: R33.2 R34.1
N$124 [HV_RDIV]: R37.1 R41.1
N$125 [HV_RDIV]: R37.2 R38.1
N$126 [HV_RDIV]: R45.1 R49.1
N$127 [HV_RDIV]: R41.2 R42.1
N$128 [HV_RDIV]: R45.2 R46.1
N$129 [HV_RDIV]: R49.2 R50.1
N$130 [HV_RDIV]: R34.2 R35.1
N$131 [HV_RDIV]: R38.2 R39.1
N$132 [HV_RDIV]: R42.2 R43.1
N$133 [HV_RDIV]: R46.2 R47.1
N$134 [HV_RDIV]: R50.2 R51.1
N$135 [HV_RDIV]: R35.2 R36.1
N$136 [HV_RDIV]: R39.2 R40.1
N$137 [HV_RDIV]: R43.2 R44.1
N$138 [HV_RDIV]: R47.2 R48.1
N$139 [HV_RDIV]: R51.2 R52.1
N$140 [HV_RDIV]: R36.2 R40.2
N$141 [HV_RDIV]: R44.2 R48.2
N$188 [GND Signal]: D29.A(ANODE) D30.C(CATHODE) Q11.3(D) RL16.2
N$189 [GND Signal]: Q11.1(G) R54.2
OUTPUT_RELAY_CTRL [GND Signal]: R54.1 R55.2 ; also sheet 3
RF_AMPLIFIED_OUT_FILT [HV_RF]: R33.1 RL16.1 ; also sheet 4
RF_OUTPUT [HV_RF]: RL16.3 X3.1 X3.2
VALVE_GND [HV_GND]: R53.1 X4.GND1 X4.GND2 X4.GND3 X4.GND4 ; also sheet 2,4

### Notes on the sheet
- Output relay and SMA Header
- Add a SO-239 header but need to ask
  about how to add this to the PCB
- Vout = 0-2.5kV
- Vout = 0-100mV
- Output relay Control
- All passives are to be rated to 10V
  Unless stated otherwise

## Library data of the parts
C1-C28 C69 = Mage-Control:C-EU: CAPACITOR, European symbol
C29-C68 = rcl:C-EU: CAPACITOR, European symbol; SPICEPREFIX: C
D1-D30 = DO-214 Diodes:SCHOTTKY_DIODE: DO-214 package regular diode Varients SMA = DO-214AC SMB = DO-214AA SMC = DO-214AB Made By: Lewis Russell 29/6/2020 Checked By: Fraser Douglas 29/6/2020
L1-L5 = Custom Inductor:T80-6: T80 Inductor Core Made By: Lewis Russe;; 10/2/21 Checked By:
P1 P2 = con-headers-jp:M-2X10-: MALE HEADER
Q1-Q11 = adafruit:MOSFET-N: N-Channel Mosfet 2N7002E - 60V 260mA SOT23 [Digikey: 2N7002ET1GOSTR-ND] - REEL BSH103 - 30V 850mA SOT23 [Digikey: 568-5013-1-ND]
R1-R3 R8-R10 = rcl:R-EU_: RESISTOR, European symbol; SPICEPREFIX: R
R4-R7 = Throughole Resistors:R-EU_W_HS: Throughole Resistor WARNING in some Resistors the rear tab is electrically connected thus Heatsink might be live IMPORTANT When using this part please set the part number in the schematic to be "-MOSFET PN- With -HEATSINK PN-" . Once the BOM has been generated manually add the Heatsink to the BOM and correct part numbers for the MOSFET _TO-247-WV-T220-101E Varient is for use with the Ohmite WV-T220-101E Heatsink, Mouser No: 588-WV-T220-101E Made By: Lewis Russell 22/3/2021 Checked By:
R11-R55 = Mage-Control:R-EU: RESISTOR, European symbol
RL1-RL16 = g5le-e:G5LE-E
T1 = BN-43-1502:BN-43-1502: BN-43-1502 wideband 2 Hole Ferrite Cores Made By: Lewis Russell 12/1/21 Checked By:
U1 U2 = ADC121S101:ADC121S101-Q: Single-Channel, 0.5 to 1-Msps, 12-Bit Analog-to-Digital Converter 2.7-5.5V supply range, -40C to +125C temperature range. Automotive qualified. Made by: Francis Pettitt Date: 11/05/20 Checked by: Jamie Slavin Date: 11/05/20
X1-X3 = _con_riacon_akl701:AKL701_2*: RIACON (Ria Connect) Screw Type Terminal Block Type AKL 701 - 2 (pole-size: 2) centerline 6.35 mm / 0.250 inches, 400 V / 24 A, horizontal wire entry, lift system, modular packages: _13: recommended pcb hole dia. = 1,3 mm _15: pcb hole dia. = 1,5 mm (prototyping) Auhtor: Dipl.-Ing. FH Rainer Bayer, Hochschule Heilbronn (rainer.bayer@hs-heilbronn.de)
X4 = adafruit:SMACONNECTOR: SMA Connector 90° DIP SMA Connector, 50 Ohm (4UConnector: 07259)

## Net classes
0 default: width 1 mm, drill 1 mm, clearance 10 mm
1 GND Signal: width 0.2 mm, drill 0.4 mm, clearance 10 mm to class 0, clearance 0.13 mm
2 RF: width 0.2 mm, drill 0.4 mm, clearance 10 mm to class 0, clearance 3.2 mm to class 1, clearance 1 mm
3 HV: width 0.2 mm, drill 0.4 mm, clearance 10 mm to class 0, clearance 14.525 mm to class 1, clearance 14.525 mm to class 2, clearance 14.525 mm
4 HV_GND: width 0.2 mm, drill 0.4 mm, clearance 1 mm to class 0, clearance 3.2 mm to class 1, clearance 0.5 mm to class 2, clearance 14.525 mm to class 3, clearance 0.13 mm
5 HV_RF: width 0.2 mm, drill 0.4 mm, clearance 10 mm to class 0, clearance 3.2 mm to class 1, clearance 3.2 mm to class 2, clearance 14.525 mm to class 3, clearance 3.2 mm to class 4, clearance 3.2 mm
6 HV_SIG: width 0.2 mm, drill 0.4 mm, clearance 10 mm to class 0, clearance 3.2 mm to class 1, clearance 3.2 mm to class 2, clearance 14.525 mm to class 3, clearance 0.13 mm to class 4, clearance 3.2 mm to class 5, clearance 0.13 mm
7 HV DIV: width 0.2 mm, drill 0.4 mm, clearance 10 mm to class 0, clearance 3.2 mm to class 1, clearance 3.2 mm to class 2, clearance 14.525 mm to class 3, clearance 1.6 mm to class 4, clearance 1.6 mm to class 5, clearance 1.6 mm to class 6, clearance 3.2 mm
8 HV_RDIV: width 0.2 mm, drill 0.4 mm, clearance 10 mm to class 0, clearance 3.2 mm to class 1, clearance 3.2 mm to class 2, clearance 14.525 mm to class 3, clearance 3.2 mm to class 4, clearance 0.5 mm to class 5, clearance 0.5 mm to class 6, clearance 0.5 mm to class 7, clearance 0.5 mm

## Board
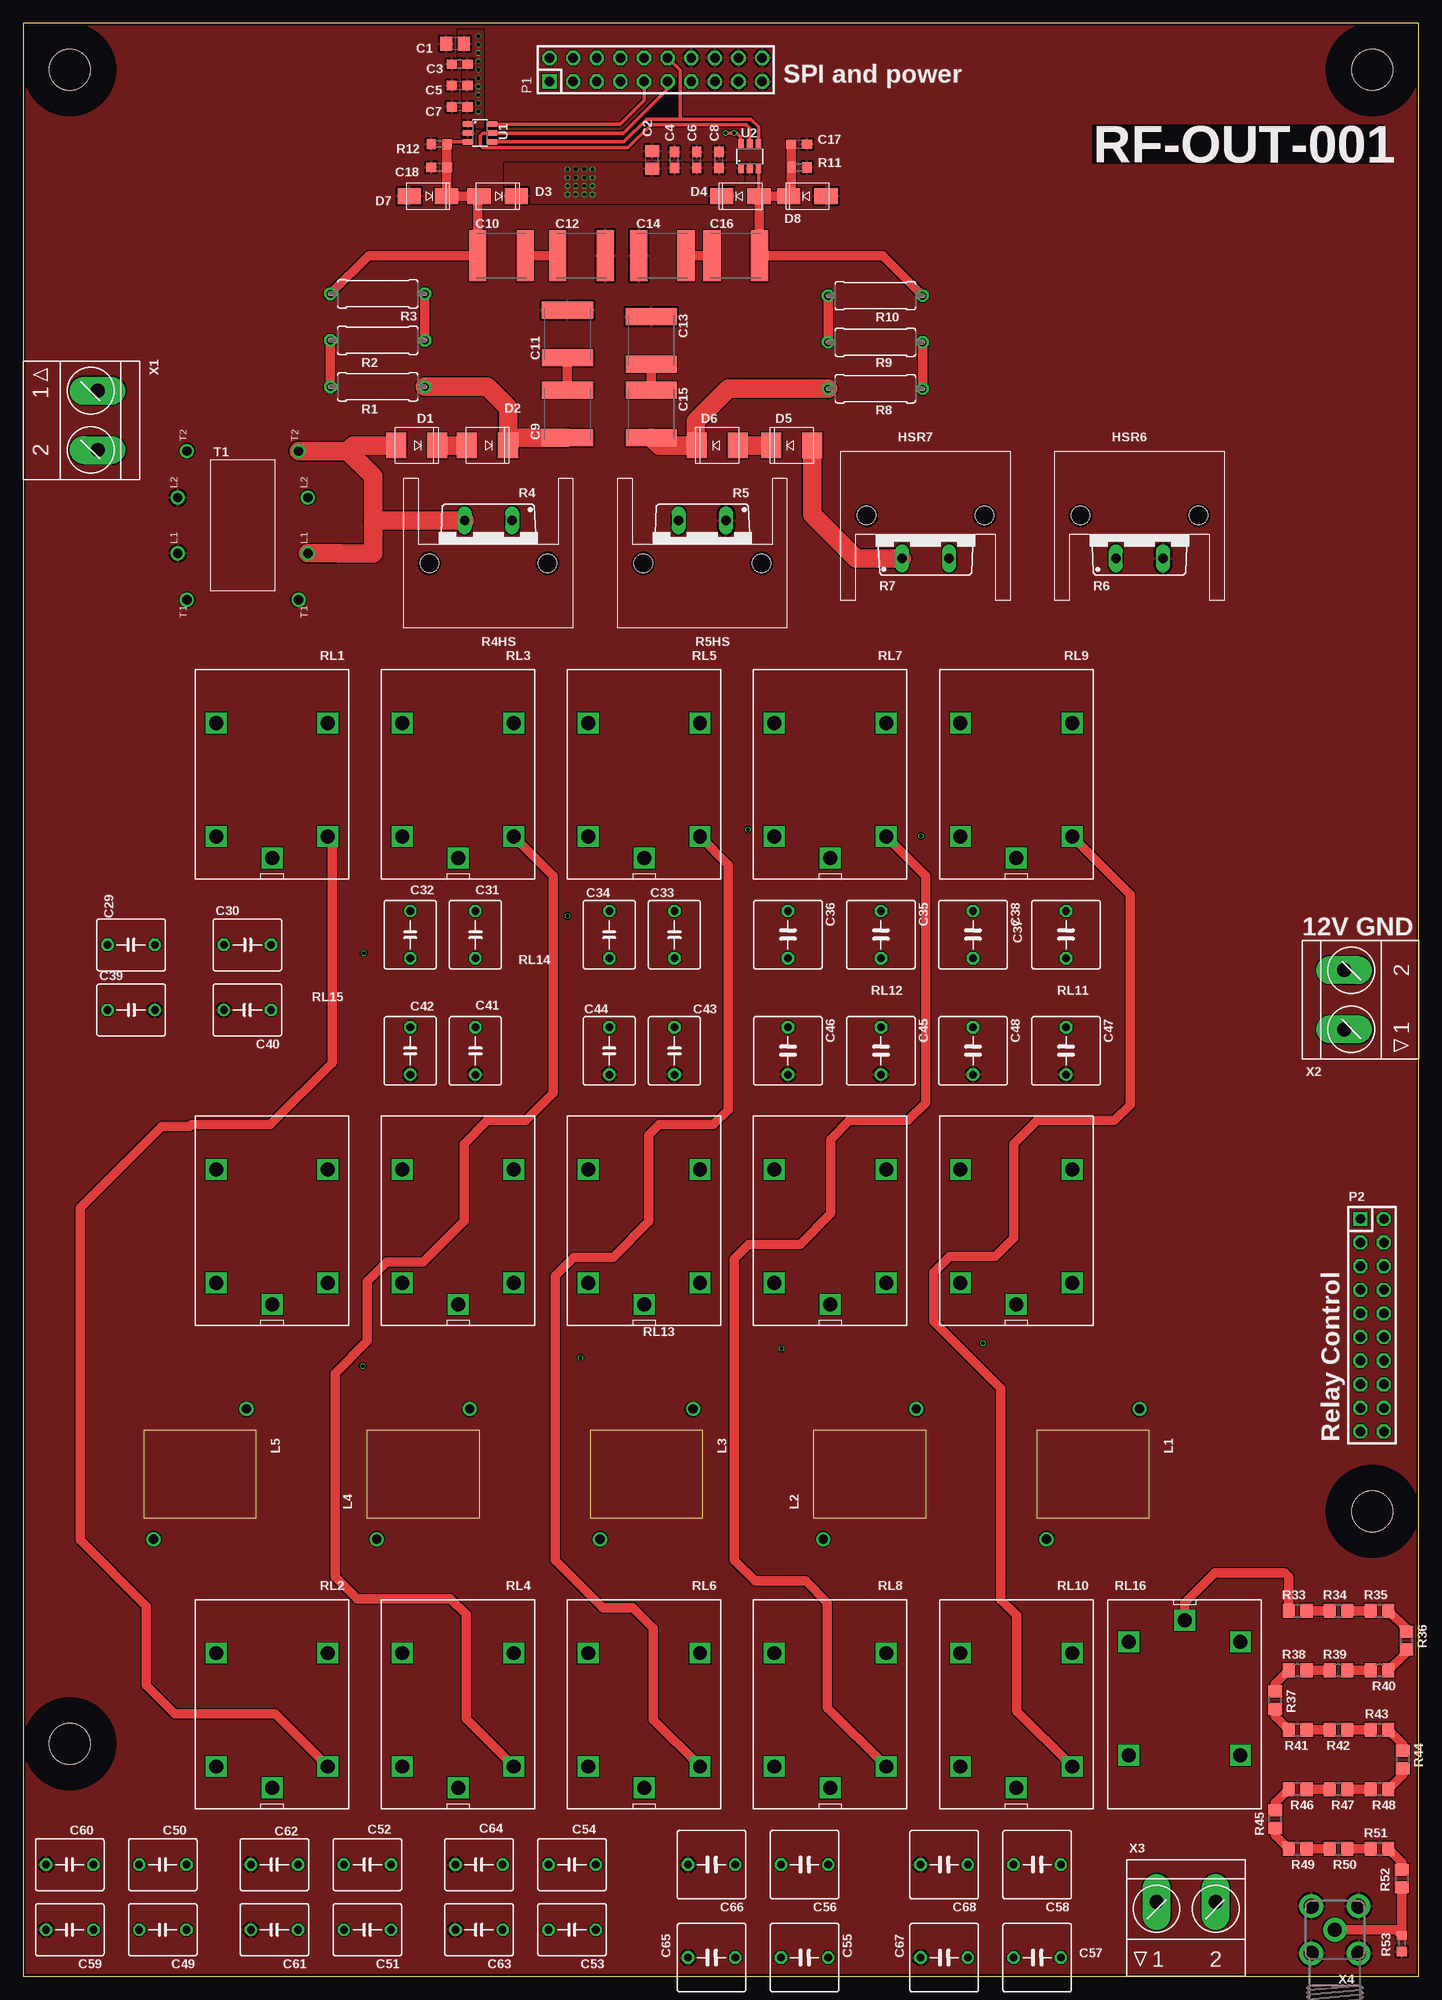
[diagram p5: board, top side]
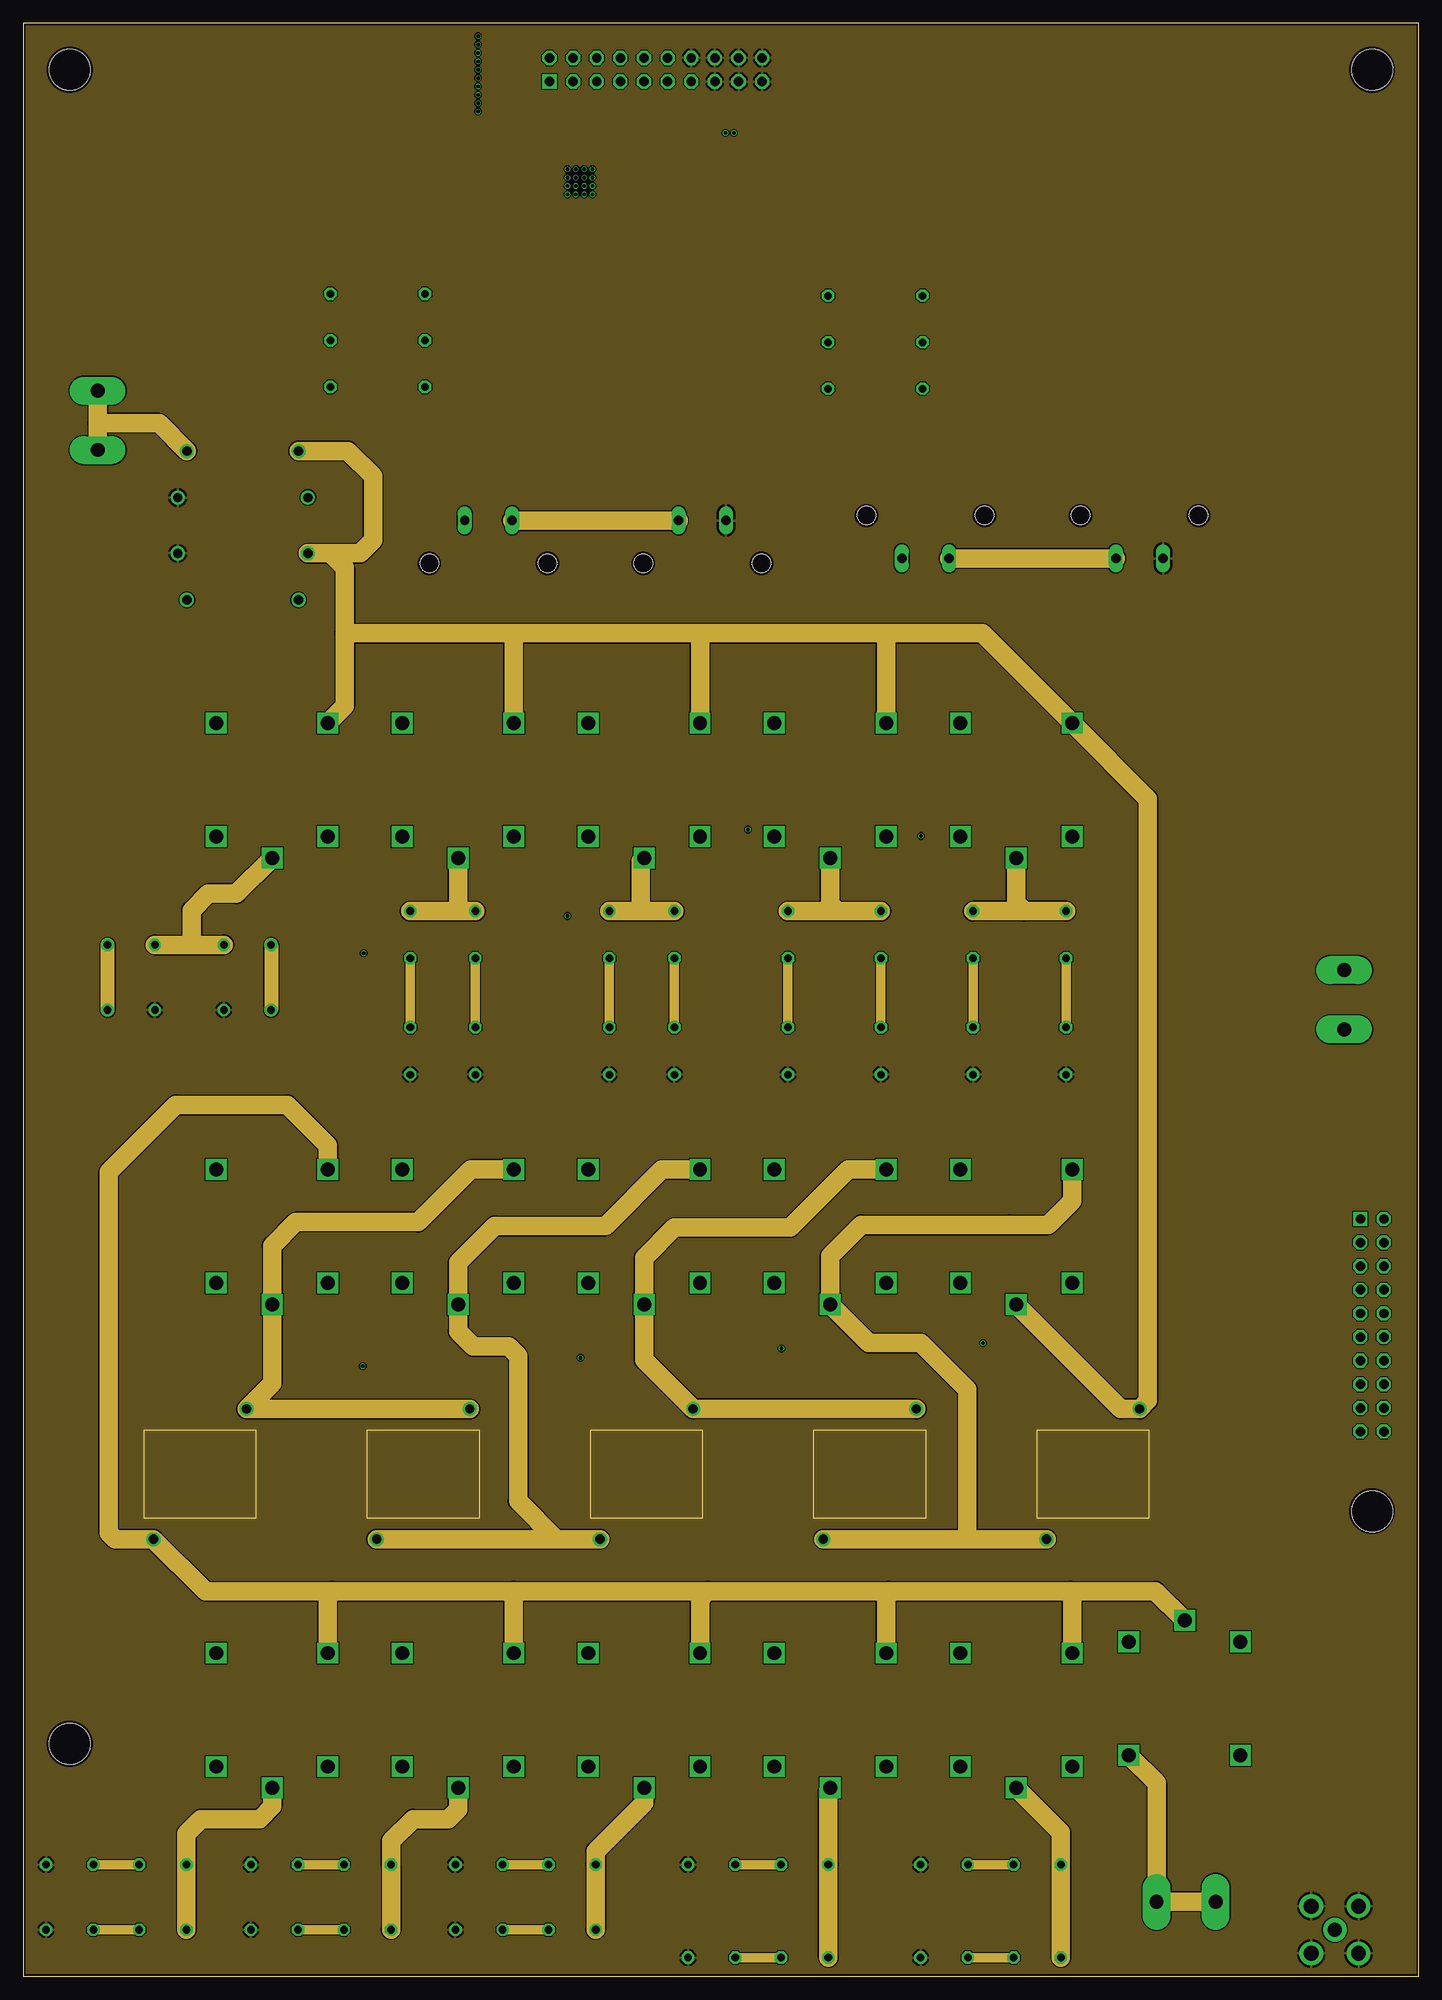
[diagram p6: board, inner layer Route2]
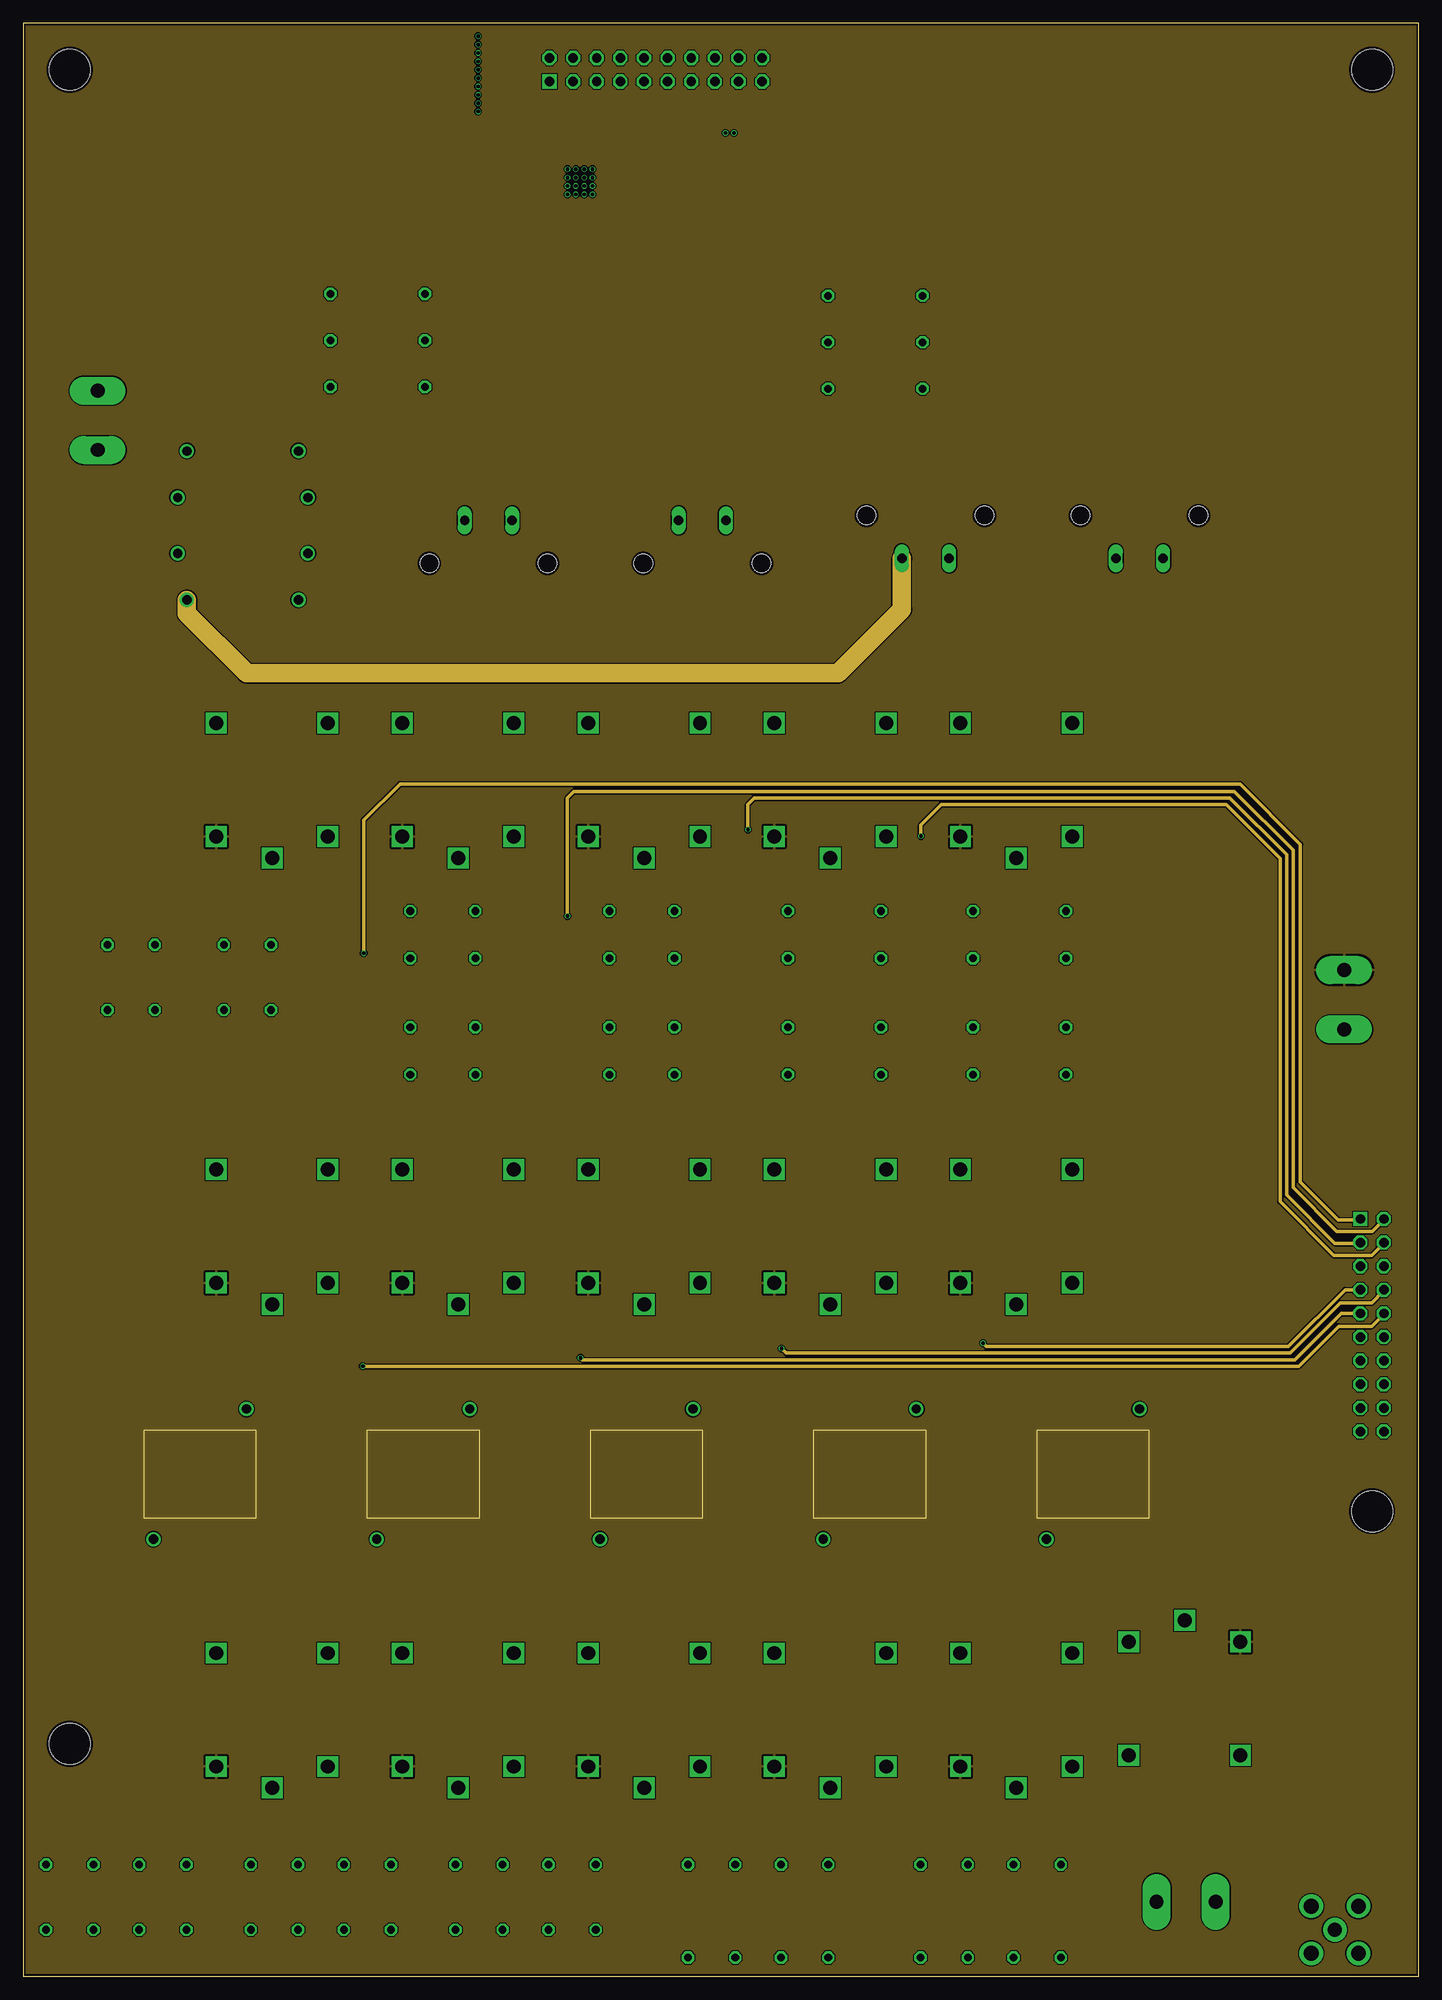
[diagram p7: board, inner layer Route3]
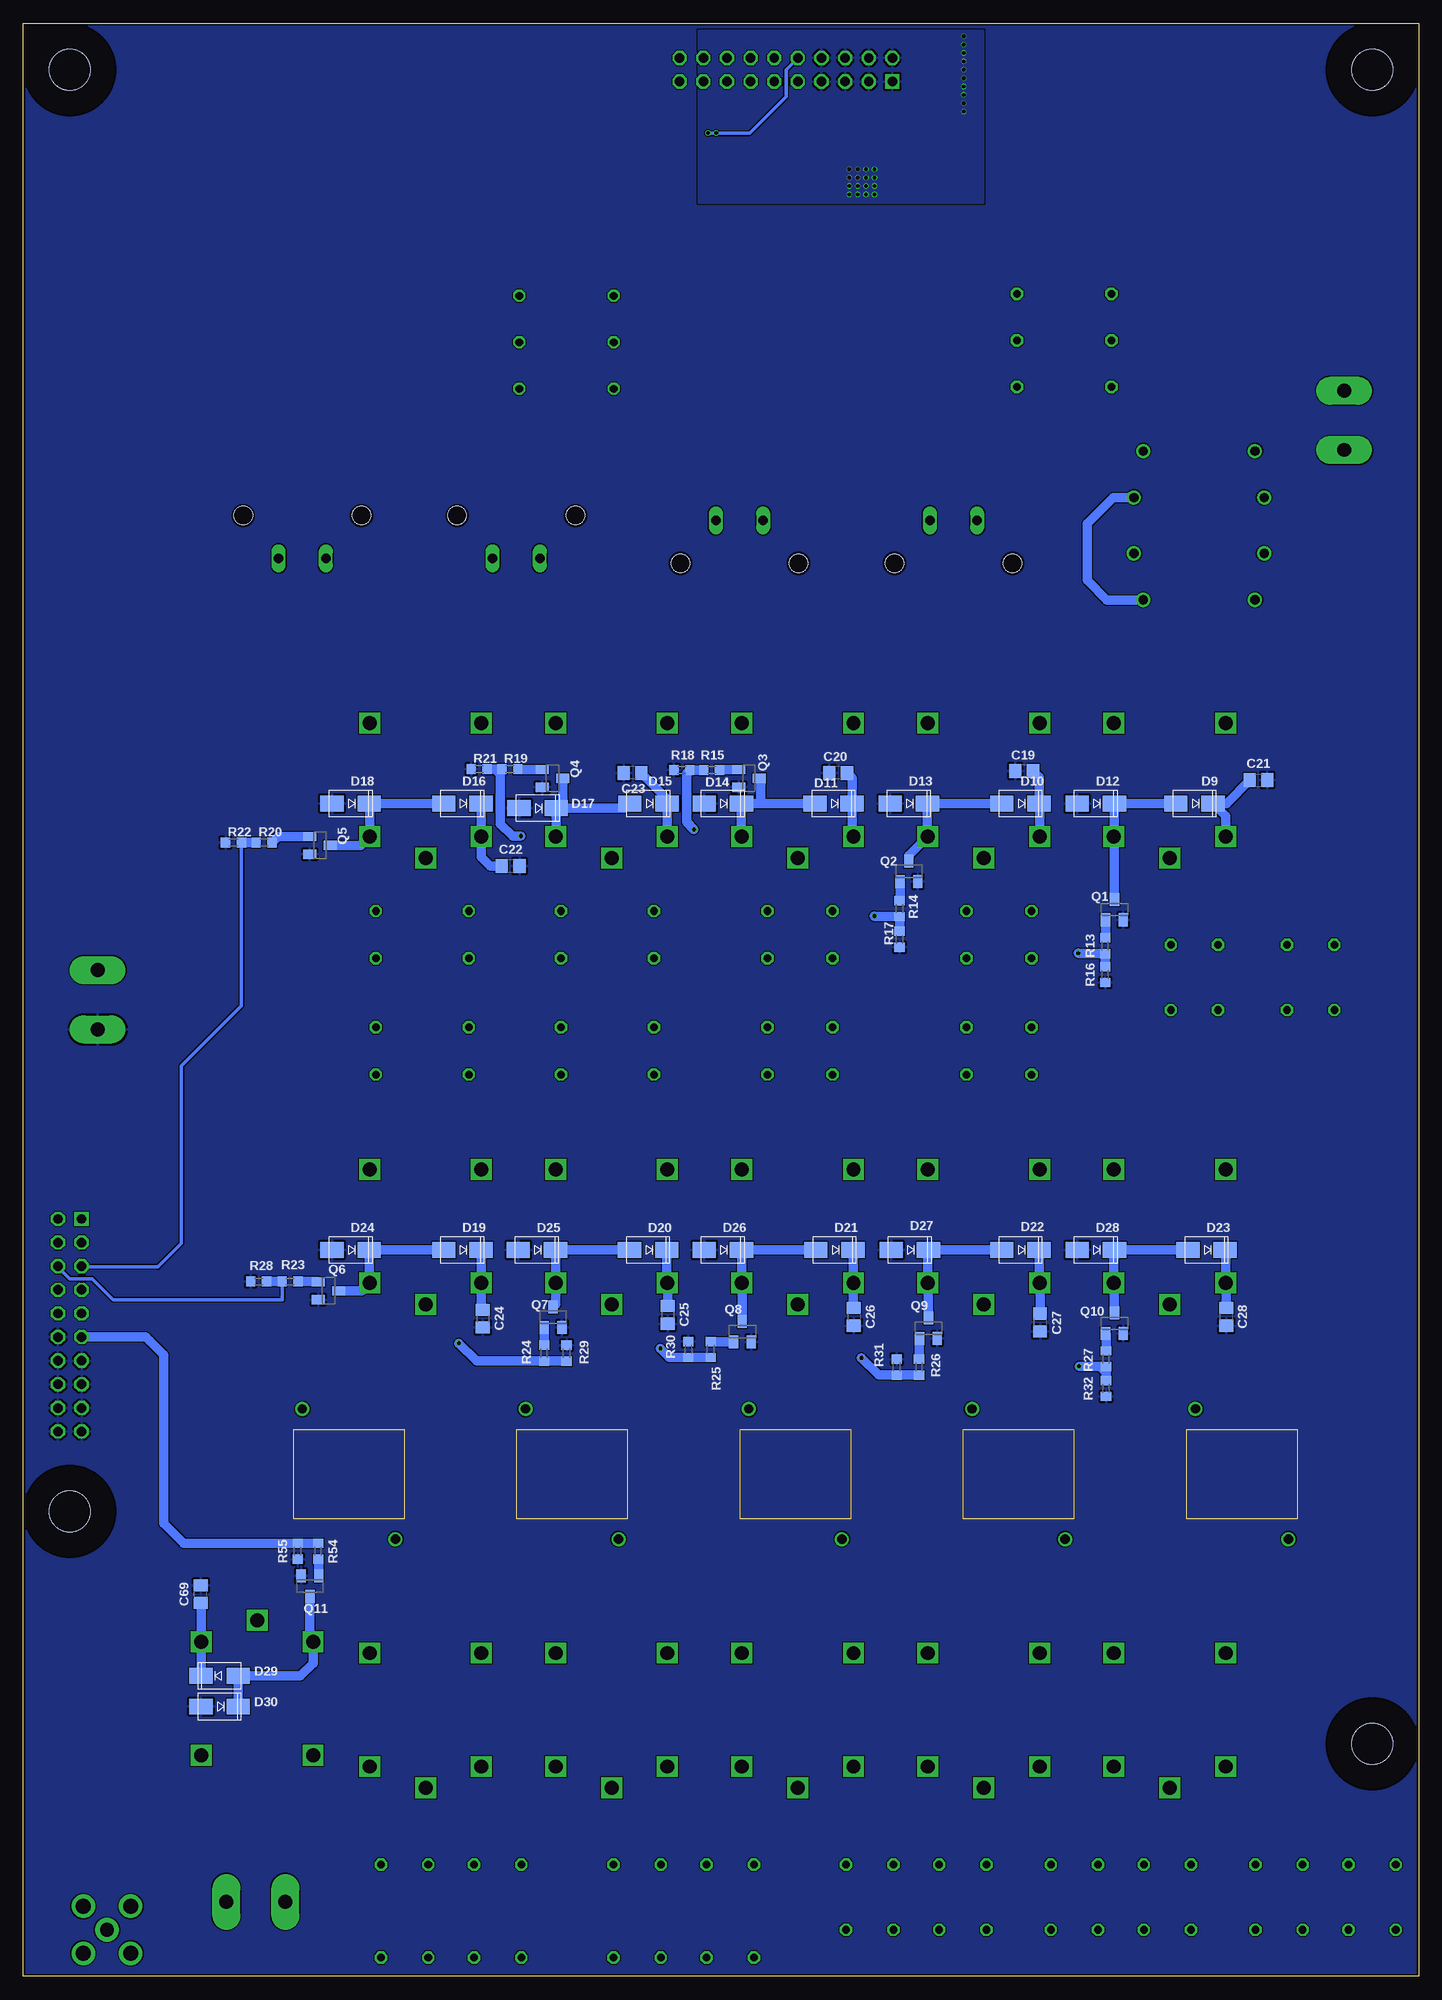
[diagram p8: board, bottom side, seen from below]

Size 150 x 210 mm. Coordinates in mm from the lower left corner, seen from the top.
Outline: 0,0 150,0 150,210 0,210 0,0
Copper layers (1+2*3+16): Top 0.035mm / dielectric 0.3mm / Route2 0.035mm / dielectric 1mm / Route3 0.035mm / dielectric 0.3mm / Bottom 0.035mm
Design rules "dirtyPCBdru4layer *": minimum track width 3.5mil, minimum drill 0.2mm, track to track 3.5mil, track to pad 3.5mil, pad to pad 3.5mil, via to via 3.5mil, smd to smd 0mil, copper to edge 10mil, drill to drill 10mil, minimum pad ring 10mil, minimum via ring 0.08mm, stop-mask expansion 2mil, vias tented up to drill 25mil, thermal gap 10mil
Holes 4.4 mm at 5,205 145,205 5,25 145,50
tRestrict: area 0,200 to 10,210; area 140,200 to 150,210; area 0,20 to 10,30; area 140,45 to 150,55
bRestrict: area 0,200 to 10,210; area 140,200 to 150,210; area 0,20 to 10,30; area 140,45 to 150,55
vRestrict: area 0,200 to 10,210; area 140,200 to 150,210; area 0,20 to 10,30; area 140,45 to 150,55

### Footprints (pad centres in the part's own frame; a part is rotated, then mirrored left to right if it is on the bottom)
C0805 = smd 1.3 x 1.5: 1 -0.95,0; 2 0.95,0
C0603 = smd 1.1 x 1: 1 -0.85,0; 2 0.85,0
C2220K = smd 1.85 x 5.5: 1 -2.55,0; 2 2.55,0
C050-055X075 = drill 0.813 octagon: 1 -2.54,0; 2 2.54,0
C050-075X075 = drill 0.813 octagon: 1 -2.54,0; 2 2.54,0
SMB/DO-214AA = smd 2.159 x 2.743: A 2.21,0; C -2.21,0
SMA/DO-214AC = smd 2.5 x 1.7: A 2,0; C -2,0
T80-6 = drill 1: 1 -7,5; 2 7,-5
DIL-100-2X10 = drill 1.016 square: 1 -11.43,-1.27 | drill 1.016 octagon: 2 -11.43,1.27; 3 -8.89,-1.27; 4 -8.89,1.27; 5 -6.35,-1.27; 6 -6.35,1.27; 7 -3.81,-1.27; 8 -3.81,1.27; 9 -1.27,-1.27; 10 -1.27,1.27; 11 1.27,-1.27; 12 1.27,1.27; 13 3.81,-1.27; 14 3.81,1.27; 15 6.35,-1.27; 16 6.35,1.27; 17 8.89,-1.27; 18 8.89,1.27; 19 11.43,-1.27; 20 11.43,1.27
SOT23 = smd 1 x 1.4: 1 -0.95,-1.1; 2 0.95,-1.1; 3 0,1.1
0309/10 = drill 0.813 octagon: 1 -5.08,0; 2 5.08,0
TO220ACS_WITH_WV-T220-101E = drill 1.016 long: 1 -2.54,-2.54; 2 2.54,-2.54 | hole 2: -6.35,2.06; 6.35,2.06
R0603 = smd 1 x 1.1: 1 -0.85,0; 2 0.85,0
R0805 = smd 1.3 x 1.5: 1 -0.95,0; 2 0.95,0
SPDT = drill 1.5 square: 1 2.25,8.25; 2 4.55,2.25; 3 16.75,2.25; 4 16.75,14.25; 5 4.55,14.25
BN-43-1502 = drill 1: L1-1 -3,7; L1-2 -3,-7; L2-1 3,7; L2-2 3,-7; T1-1 -8,6; T1-2 -8,-6; T2-1 8,6; T2-2 8,-6
SOT23-6 = smd 0.6 x 1.1: 1 -0.95,-1.3; 2 0,-1.3; 3 0.95,-1.3; 4 0.95,1.3; 5 0,1.3; 6 -0.95,1.3
AKL701_2_15 = drill 1.5 pad 3 long: 1 -3.175,0; 2 3.175,0
SMA90_DIP = drill 1.5 pad 2.54: ANTENNA 0,0 | drill 1.6 pad 2.54: GND1 -2.54,2.54; GND2 2.54,2.54; GND3 -2.54,-2.54; GND4 2.54,-2.54

### Placement (x,y rotation side)
C1  46.4,207.8 180 top
C2  67.6,195.3 90 top
C3  46.9,205.6 180 top
C4  70,195.3 90 top
C5  46.9,203.3 180 top
C6  72.4,195.3 90 top
C7  46.9,201 180 top
C8  74.8,195.3 90 top
C9  58.5,168 90 top
C10  51.4,185 0 top
C11  58.5,176.6 90 top
C12  60,185 0 top
C13  67.5,175.9 270 top
C14  68.7,185 0 top
C15  67.5,168 270 top
C16  76.6,185 0 top
C17  83.4,197 0 top
C18  44.7,194.5 180 top
C19  42.4,129.6 180 bottom
C20  62.4,129.4 180 bottom
C21  17.2,128.6 0 bottom
C22  97.6,119.4 0 bottom
C23  84.5,129.4 180 bottom
C24  100.6,70.7 270 bottom
C25  80.71,71.12 270 bottom
C26  60.7,70.9 270 bottom
C27  40.7,70.3 270 bottom
C28  20.7,70.9 270 bottom
C29  11.6,110.9 180 top
C30  24.1,110.9 0 top
C31  48.6,112 270 top
C32  41.6,112 270 top
C33  70,112 270 top
C34  63,112 270 top
C35  92.2,112 270 top
C36  82.2,112 270 top
C37  112.1,112 270 top
C38  102.1,112 270 top
C39  11.6,103.9 0 top
C40  24.1,103.9 180 top
C41  48.6,99.5 270 top
C42  41.6,99.5 270 top
C43  70,99.5 270 top
C44  63,99.5 270 top
C45  92.2,99.5 270 top
C46  82.2,99.5 270 top
C47  112.1,99.5 270 top
C48  102.1,99.5 270 top
C49  15,5 180 top
C50  15,12 180 top
C51  37,5 180 top
C52  37,12 180 top
C53  59,5 180 top
C54  59,12 180 top
C55  84,2 180 top
C56  84,12 180 top
C57  109,2 180 top
C58  109,12 180 top
C59  5,5 180 top
C60  5,12 180 top
C61  27,5 180 top
C62  27,12 180 top
C63  49,5 180 top
C64  49,12 180 top
C65  74,2 180 top
C66  74,12 180 top
C67  99,2 180 top
C68  99,12 180 top
C69  130.94,41.08 90 bottom
D1  42.3,164.6 180 top
D2  49.9,164.6 180 top
D3  51,191.4 180 top
D4  77.1,191.4 0 top
D5  82.6,164.6 0 top
D6  74.6,164.6 0 top
D7  43.5,191.4 180 top
D8  84.3,191.4 0 top
D9  24.1,126.1 180 bottom
D10  42.8,126.1 180 bottom
D11  62.9,126.1 180 bottom
D12  34.7,126.1 180 bottom
D13  54.8,126.1 180 bottom
D14  74.8,126.1 180 bottom
D15  82.8,126.1 180 bottom
D16  102.8,126.1 180 bottom
D17  94.7,125.6 180 bottom
D18  114.8,126.1 180 bottom
D19  102.8,78.1 180 bottom
D20  82.83,78.09 180 bottom
D21  62.8,78.1 180 bottom
D22  42.8,78.1 180 bottom
D23  22.8,78.1 180 bottom
D24  114.8,78.1 180 bottom
D25  94.79,78.09 180 bottom
D26  74.8,78.1 180 bottom
D27  54.7,78.1 180 bottom
D28  34.7,78.1 180 bottom
D29  128.9,32.3 0 bottom
D30  128.9,29 180 bottom
L1  115,54 270 top
L2  91,54 90 top
L3  67,54 270 top
L4  43,54 90 top
L5  19,54 270 top
P1  68,205 0 top
P2  145,70 270 top
Q1  32.7,114.7 0 bottom
Q2  54.8,118.8 0 bottom
Q3  72,128.8 270 bottom
Q4  93.1,128.8 270 bottom
Q5  118.1,121.6 270 bottom
Q6  117.2,73.7 270 bottom
Q7  93.05,70.86 0 bottom
Q8  72.7,69.3 0 bottom
Q9  52.7,69.7 0 bottom
Q10  32.7,70.2 0 bottom
Q11  119.19,41.94 180 bottom
R1  38.1,170.9 180 top
R2  38.1,175.9 0 top
R3  38.1,180.9 180 top
R4  50,154 180 top
R5  73,154 180 top
R6  120,155 0 top
R7  97,155 0 top
R8  91.6,170.7 0 top
R9  91.6,175.7 180 top
R10  91.6,180.7 0 top
R11  83.4,194.5 180 top
R12  44.7,197 0 top
R13  33.7,110.8 90 bottom
R14  55.8,114.8 90 bottom
R15  76,129.7 0 bottom
R16  33.7,107.7 90 bottom
R17  55.8,111.5 90 bottom
R18  79.2,129.7 0 bottom
R19  97.7,129.8 0 bottom
R20  124.1,121.9 0 bottom
R21  101,129.8 0 bottom
R22  127.4,121.9 0 bottom
R23  121.3,74.7 0 bottom
R24  94,67 90 bottom
R25  76.1,67.4 90 bottom
R26  53.7,65.5 90 bottom
R27  33.6,66.4 90 bottom
R28  124.7,74.7 0 bottom
R29  91.6,67 270 bottom
R30  78.5,67.4 270 bottom
R31  56.1,65.5 270 bottom
R32  33.6,63.2 90 bottom
R33  137,39.3 0 top
R34  141.4,39.3 0 top
R35  145.8,39.3 0 top
R36  148.7,36.1 270 top
R37  134.6,29.7 90 top
R38  137,32.9 0 top
R39  141.4,32.9 0 top
R40  145.8,32.9 0 top
R41  137,26.5 0 top
R42  141.4,26.5 0 top
R43  145.8,26.5 0 top
R44  148.3,23.3 270 top
R45  134.6,16.9 90 top
R46  137,20.1 0 top
R47  141.4,20.1 0 top
R48  145.8,20.1 0 top
R49  137,13.7 0 top
R50  141.4,13.7 0 top
R51  145.8,13.7 0 top
R52  148.2,10.5 270 top
R53  148.2,3.5 90 top
R54  118.3,45.7 270 bottom
R55  120.5,45.7 90 bottom
RL1  35,118 90 top
RL2  35,18 90 top
RL3  55,118 90 top
RL4  55,18 90 top
RL5  75,118 90 top
RL6  75,18 90 top
RL7  95,118 90 top
RL8  95,18 90 top
RL9  115,118 90 top
RL10  115,18 90 top
RL11  115,70 90 top
RL12  95,70 90 top
RL13  75,70 90 top
RL14  55,70 90 top
RL15  35,70 90 top
RL16  116.6,40.5 270 top
T1  23.6,156 90 top
U1  49.1,198.2 270 top
U2  78.1,195.7 0 top
X1  8,167.3 270 top
X2  142,105 90 top
X3  125,8 0 top
X4  141,5 180 top

### Tracks (layer width: path | path; a pad name or v marks a point on that pad's centre or on a via)
!V_OUT_FWD_SS
  Top 0.4: U1.6 64.15,199.15 66.73,201.73 P1.9
!V_OUT_RVS_SS  (via drill 0.4)
  Top 0.4: U2.6 77.15,197.75 76.7,198.2 v76.4,198.2 v75.5,198.2
  Bottom 0.4: v76.4,198.2 v75.5,198.2 71.9,198.2 68,202.1 68,205 P1.10
+12V
  Bottom 1: RL1.5 20.75,124.75 D9.C 20.65,126.1 C21.1 | RL3.5 40.75,126.05 D10.C 40.8,128.95 C19.1 | RL5.5 60.9,122.7 D11.C 60.9,128.85 C20.1 | RL7.5 80.75,126.05 D15.C 80.8,126.65 C23.1 | D16.C 100.75,126.05 RL9.5 100.75,120.35 99.8,119.4 C22.1 | C69.1 130.85,40.04 RL16.5 130.85,32.35 D29.C | D19.C 100.75,78.05 RL11.5 100.75,71.8 C24.1 | D20.C 80.83,74.63 RL12.5 80.71,74.51 C25.1 | D21.C 60.8,74.6 RL13.5 60.75,71.9 C26.1 | D22.C 40.8,74.6 RL14.5 40.7,74.5 C27.1 | D23.C 20.75,78.05 RL15.5 20.7,74.5 C28.1
  pour Route3 (rank 5): -1.4,211.4 151.4,211.4 151.4,-1.4 -1.4,-1.4
FILT_CAP_CTRL_0  (via drill 0.4)
  Route3 0.4: v36.6,110 36.6,124.3 40.5,128.2 130.8,128.2 137.3,121.7 137.3,85.4 141.35,81.35 143.65,81.35 P2.1
  Bottom 1: R16.2 R13.1 36.55,109.95 v36.6,110
FILT_CAP_CTRL_1  (via drill 0.4)
  Route3 0.4: v58.5,114 58.5,126.7 59.2,127.4 130.2,127.4 136.5,121.1 136.5,84.8 141.2,80.1 145.02,80.1 146.27,81.35 P2.2
  Bottom 1: R17.2 R14.1 58.45,113.95 v58.5,114
FILT_CAP_CTRL_2  (via drill 0.4)
  Route3 0.4: P2.3 143.65,78.81 140.99,78.81 135.8,84 135.8,120.6 129.7,126.7 78.6,126.7 77.9,126 v77.9,123.3
  Bottom 1: R15.1 R18.2 78.7,129.35 78.7,124.1 v77.9,123.3
FILT_CAP_CTRL_3  (via drill 0.4)
  Route3 0.4: v96.5,122.6 96.5,123.8 98.7,126 129.3,126 135.1,120.2 135.1,83.3 140.9,77.5 144.96,77.5 146.27,78.81 P2.4
  Bottom 1: R19.1 99.3,129.8 | 99.3,129.8 R21.2 | 99.3,129.8 98.7,129.2 98.7,123.9 97.4,122.6 v96.5,122.6
FILT_CAP_CTRL_4
  Bottom 0.4: P2.5 143.65,76.27 135.53,76.27 133,78.8 133,97.9 126.55,104.35 R22.2
  Bottom 1: R22.2 R20.1
FILT_INDUCT_CTRL_0
  Bottom 0.4: R23.1 122.15,72.75 140.35,72.75 142.6,75 145,75 146.27,76.27 P2.6
  Bottom 1: R23.1 R28.2
FILT_INDUCT_CTRL_1  (via drill 0.4)
  Route3 0.4: v103.17,68.07 103.54,67.7 136,67.7 142.11,73.81 P2.7
  Bottom 1: R29.2 R24.1 101.25,66.15 v103.17,68.07
FILT_INDUCT_CTRL_2  (via drill 0.4)
  Route3 0.4: v81.5,67.5 82,67 136.2,67 141.6,72.4 144.94,72.4 146.27,73.73 P2.8
  Bottom 1: R25.1 R30.2 80.55,66.55 v81.5,67.5
FILT_INDUCT_CTRL_3  (via drill 0.4)
  Route3 0.4: v59.9,66.5 60.1,66.3 136.7,66.3 141.67,71.27 P2.9
  Bottom 1: R26.1 R31.2 58.05,64.65 v59.9,66.5
FILT_INDUCT_CTRL_4  (via drill 0.4)
  Route3 0.4: v36.5,65.6 137.1,65.6 141.4,69.9 144.98,69.9 146.27,71.19 P2.10
  Bottom 1: R32.2 33.6,64.9 | 33.6,64.9 R27.1 | 33.6,64.9 34.3,65.6 v36.5,65.6
FWD
  Top 0.4: R12.2 45.8,197.25 U1.3
  Top 1: R3.2 37.12,185 C10.1 48.85,191.25 D3.A D7.C 45.55,191.45 C18.1 R12.2
GND
  pour Bottom (rank 5): -1.6,211.6 151.6,211.6 151.6,-1.6 -1.6,-1.6
N$6
  Route2 2: C29.1 18.1,110.9 | 18.1,110.9 C30.1 | RL1.1 22.9,116.4 19.9,116.4 18.1,114.6 18.1,110.9
N$7
  Route2 2: C37.1 107.6,114.54 | 107.6,114.54 C38.1 | 107.6,114.54 106.75,115.39 RL9.1
N$13
  Route2 2: RL2.1 26.75,18.25 25.4,16.9 19.1,16.9 17.54,15.34 C50.1 C49.1
N$14
  Route2 2: C51.1 C52.1 39.54,14.54 41.9,16.9 45.7,16.9 46.75,17.95 RL4.1
N$20
  Route2 2: RL6.1 66.75,18.65 61.54,13.44 C54.1 C53.1
N$21
  Route2 2: C55.1 C56.1 86.54,20.04 RL8.1
N$22
  Route2 1.5: C39.1 C29.2
N$24
  Route2 1: C32.2 C42.1
N$25
  Route2 1.5: C30.2 C40.1
N$26
  Route2 1: C34.2 C44.1
N$27
  Route2 1: C36.2 C46.1
N$28
  Route2 1: C38.2 C48.1
N$29
  Route2 1: C41.1 C31.2
N$30
  Route2 1: C33.2 C43.1
N$31
  Route2 1: C45.1 C35.2
N$32
  Route2 1: C37.2 C47.1
N$33
  Route2 2: RL10.1 111.54,15.46 C58.1 C57.1
N$34
  Top 1: R52.2 R53.2 147.55,5 X4.ANTENNA
N$35
  Route2 1: C62.1 C52.2
N$36
  Route2 1: C60.1 C50.2
N$37
  Route2 1: C64.1 C54.2
N$38
  Route2 1: C66.1 C56.2
N$39
  Route2 1: C68.1 C58.2
N$40
  Route2 1: C59.1 C49.2
N$41
  Route2 1: C61.1 C51.2
N$42
  Route2 1: C63.1 C53.2
N$43
  Route2 1: C65.1 C55.2
N$44
  Route2 1: C67.1 C57.2
N$123
  Top 1: R33.2 R34.1
N$124
  Top 1: R41.1 134.6,27.95 R37.1
N$125
  Top 1: R37.2 134.6,31.45 R38.1
N$126
  Top 1: R49.1 134.6,15.15 R45.1
N$127
  Top 1: R41.2 R42.1
N$128
  Top 1: R45.2 134.6,18.65 R46.1
N$129
  Top 1: R50.1 R49.2
N$130
  Top 1: R34.2 R35.1
N$131
  Top 1: R38.2 R39.1
N$132
  Top 1: R43.1 R42.2
N$133
  Top 1: R46.2 R47.1
N$134
  Top 1: R51.1 R50.2
N$135
  Top 1: R36.1 148.7,37.35 R35.2
N$136
  Top 1: R39.2 R40.1
N$137
  Top 1: R44.1 148.3,24.95 R43.2
N$138
  Top 1: R47.2 R48.1
N$139
  Top 1: R51.2 148.2,12.25 R52.1
N$140
  Top 1: R40.2 148.7,34.85 R36.2
N$141
  Top 1: R48.2 148.3,21.65 R44.2
N$150
  Top 1: RL2.2 27.1,28.2 16.3,28.2 13.2,31.3 13.2,39.8 6.1,46.9 6.1,82.6 14.9,91.4 17.92,91.4 18.09,91.58 26.57,91.58 33.2,98.2 33.2,122.1 RL1.2
  Bottom 1: D9.A D12.C 32.7,122.6 | 32.7,122.6 RL1.2 | Q1.3 32.7,122.6
N$162
  Bottom 1: R13.2 33.65,111.7 Q1.1
N$163
  Top 1: RL4.2 47.6,27.7 47.6,38.9 45.9,40.6 35.9,40.6 33.55,42.95 33.55,64.85 37,68.3 37,74.7 39.1,76.8 43,76.8 47.4,81.2 47.4,89.5 49.9,92 54,92 57,95 57,118.3 RL3.2
  Bottom 1: D10.A D13.C 52.8,122.6 RL3.2 54.8,120.5 Q2.3
N$175
  Bottom 1: Q2.1 55.75,115.7 R14.2
N$176
  Top 1: RL6.2 67.7,27.6 67.7,37.4 65.5,39.6 62.3,39.6 57.2,44.7 57.2,75.3 59.2,77.3 63.4,77.3 67.25,81.15 67.25,90.45 68.38,91.58 74.2,91.58 75.8,93.17 75.8,119.5 RL5.2
  Bottom 1: D11.A 70.7,126.1 | 70.7,126.1 D14.C 72.8,122.6 RL5.2 | 70.7,126.1 70.7,128.6 Q3.3
N$188
  Bottom 1: D30.C D29.A 120.2,32.3 118.85,33.65 RL16.2 119.19,36.29 Q11.3
N$189
  Bottom 1: Q11.1 118.24,44.79 R54.2
N$196
  Bottom 1: T1.L2-2 32.8,159 35.6,156.2 35.6,150.1 33.5,148 T1.T1-2
N$198
  Route2 2: R4.1 R5.2
N$199
  Route2 2: R6.1 R7.2
N$200
  Top 1: C9.2 C11.1
N$201
  Top 2: D1.C D2.A
N$203
  Top 2: C9.1 52.96,165.45 D2.C 52.11,168.69 49.9,170.9 R1.1
N$204
  Top 1: R1.2 R2.1
N$205
  Top 1: C10.2 C12.1
N$207
  Top 1: R2.2 R3.1
N$209
  Top 1: C15.1 C13.2
N$210
  Top 2: D5.C D6.A
N$211
  Top 1: C15.2 | 72.31,164.52 D6.C
  Top 2: R8.1 75.8,170.7 72.31,167.21 72.31,164.52 | D6.C 68.35,164.6 C15.2
N$212
  Top 1: C14.2 C16.1
N$214
  Top 1: R9.1 R8.2
N$215
  Top 1: R10.1 R9.2
N$216
  Top 2: R7.1 89.54,152.46 84.81,157.19 D5.A
  Route3 2: T1.T1-1 17.6,146.5 24,140.1 87.6,140.1 94.46,146.96 R7.1
N$249
  Route2 2: C34.1 66.4,114.54 | 66.4,114.54 C33.1 | 66.4,114.54 66.4,119.9 RL5.1
N$251
  Route2 2: C36.1 87.5,114.54 | 87.5,114.54 C35.1 | 87.5,114.54 86.75,115.29 RL7.1
N$252
  Route2 2: C32.1 47.3,114.54 | 47.3,114.54 C31.1 | 47.3,114.54 46.75,115.09 RL3.1
N$301
  Bottom 1: Q3.1 75.1,129.75 R15.2
N$303
  Top 1: RL8.2 86.45,28.85 86.45,40.15 84.1,42.5 78.7,42.5 76.45,44.75 76.45,77.15 78,78.7 83.5,78.7 86.8,82 86.8,90 88.8,92 95.1,92 97,93.9 97,118.3 RL7.2
  Bottom 1: D15.A 85.3,125.6 D17.C | D17.C 92.7,122.6 RL7.2 | D17.C 92,126.3 Q4.3
N$305
  Bottom 1: Q4.1 96.8,129.75 R19.2
N$306
  Top 1: RL10.2 106.8,28.5 106.8,38.8 105.1,40.5 105.1,63.2 97.9,70.4 97.9,75.7 99.6,77.4 104.5,77.4 106.5,79.4 106.5,89.5 109,92 117.3,92 119,93.7 119,116.3 RL9.2
  Bottom 1: 112.75,126.05 RL9.2 113.7,121.6 Q5.3 | 112.75,126.05 D18.C | D16.A 112.7,126.1 112.75,126.05
N$307
  Bottom 1: Q5.1 122.6,122.55 R20.2
N$312
  Bottom 1: Q6.3 113.6,73.7 RL11.2 112.8,74.6 D24.C D19.A
N$314
  Bottom 1: R23.2 118.35,74.7 Q6.1
N$315
  Bottom 1: D20.A D25.C 92.75,78.05 RL12.2 92.75,72.26 Q7.3
N$316
  Bottom 1: R24.2 Q7.1
N$317
  Bottom 1: Q8.3 72.7,74.5 RL13.2 72.75,78.05 D26.C D21.A
N$318
  Bottom 1: R25.2 76.05,68.2 Q8.1
N$323
  Bottom 1: D22.A D27.C 52.75,78.05 RL14.2 52.7,74.5 Q9.3
N$324
  Bottom 1: R26.2 53.7,68.55 Q9.1
N$325
  Bottom 1: Q10.3 32.7,74.5 RL15.2 32.75,78.05 D28.C D23.A
N$326
  Bottom 1: R27.2 33.6,69.05 Q10.1
N$338
  Route2 2: L4.2 L5.1 26.75,63.75 RL15.1 26.75,78.55 29.3,81.1 42.46,81.1 48.11,86.75 RL14.3
N$339
  Route2 2: RL13.3 68.65,86.75 62.6,80.7 50.7,80.7 46.75,76.75 RL14.1 46.75,69.35 48.4,67.7 52.2,67.7 53.2,66.7 53.2,51.1 57.3,47 | L3.2 57.3,47 | 57.3,47 L4.1
N$340
  Route2 2: L2.2 L3.1 66.75,66.25 RL13.1 66.75,77.25 70,80.5 82.45,80.5 88.7,86.75 RL12.3
N$341
  Route2 2: L1.2 101.4,47 | 101.4,47 L2.1 | RL11.3 112.75,83.35 110.2,80.8 106,80.8 90.1,80.8 86.75,77.45 RL12.1 90.9,68.1 96.5,68.1 101.5,63.1 101.5,47.1 101.4,47
OUTPUT_RELAY_CTRL
  Bottom 1: R54.1 R55.2 132.75,46.55 134.9,48.7 134.9,66.8 136.4,68.3 136.75,68.65 136.83,68.73 P2.11
RF_AMPLIFIED_OUT_FILT
  Top 1: R33.1 136.05,42.95 135.6,43.4 128.1,43.4 124.85,40.15 RL16.1
  Route2 2: RL16.1 121.7,41.4 112.6,41.4 | 33.2,41.4 19.6,41.4 L5.2 9.9,47 9.2,47.7 9.2,86.5 16.4,93.7 28.4,93.7 32.75,89.35 RL15.3 | 33.2,41.4 52.7,41.4 | 52.7,41.4 73.6,41.4 | 73.6,41.4 93,41.4 | 93,41.4 112.6,41.4 | RL10.3 112.75,41.25 112.6,41.4 | RL8.3 92.75,41.15 93,41.4 | RL6.3 72.75,40.55 73.6,41.4 | RL4.3 52.75,41.35 52.7,41.4 | RL2.3 32.75,40.95 33.2,41.4
RF_AMPLIFIED_OUT_TRANS
  Top 2: T1.L1-2 34,153 34.01,152.99 37.6,152.99 37.6,156.5 | T1.T2-2 34.9,164 | 37.6,156.5 37.6,161.3 34.9,164 | D1.A 35.5,164.6 34.9,164 | R4.2 37.64,156.54 37.6,156.5
  Route2 2: 34.55,144.4 34.55,151.45 33,153 T1.L1-2 36.2,153 37.6,154.4 37.6,161.3 34.9,164 T1.T2-2 | 34.55,144.4 34.55,136.55 RL1.3 | 34.55,144.4 53.2,144.4 | 53.2,144.4 72.9,144.4 | 72.9,144.4 93.3,144.4 | 93.3,144.4 103.1,144.4 RL9.3 120.9,126.6 120.9,61.9 L1.1 118,61 RL11.1 | RL7.3 92.75,143.85 93.3,144.4 | RL5.3 72.75,144.25 72.9,144.4 | RL3.3 52.75,143.95 53.2,144.4
RF_AMPLIFIED_OUT_UNFILT
  Route2 2: X1.1 8,167 | 8,167 X1.2 | T1.T2-1 14.6,167 8,167
RF_OUTPUT
  Route2 2: X3.2 X3.1 121.83,20.77 RL16.3
RVS
  Top 0.4: D4.A 79.05,191.45 U2.3
  Top 1: R10.2 92.38,185 C16.2 79.1,185.05 D4.A D8.C 82.55,191.65 R11.2 C17.1
V_MISO
  Top 0.4: U2.5 78.1,198.7 77.7,199.1 67.5,199.1 65,196.6 49.4,196.6 49.1,196.9 49.1,197.9 49.4,198.2 U1.5 64.5,198.2 69.27,202.97 P1.11
V_SCLK
  Top 0.4: U1.4 64.55,197.25 67,199.7 70.6,199.7 | U2.4 79.05,198.85 78.2,199.7 70.6,199.7 | 70.6,199.7 70.6,204.94 P1.12
VALVE_5V  (via drill 0.4)
  other vias: 48.9,208.6 48.9,207.7 48.9,206.8 48.9,205.9 48.9,205 48.9,204.1 48.9,203.2 48.9,202.3 48.9,201.4 48.9,200.5 58.5,194.3 59.4,194.3 60.3,194.3 58.5,193.4 59.4,193.4 60.3,193.4 60.3,192.5 59.4,192.5 58.5,192.5 60.3,191.6 59.4,191.6 58.5,191.6 61.2,191.6 61.2,192.5 61.2,193.4 61.2,194.3
  pour Top: 46.8,209.2 46.8,206.5 47.3,206.5 47.3,198.8 49.4,198.8 49.4,209.2
  pour Top: 51.8,190.7 76.4,190.7 76.4,193 77.4,193 77.4,194.9 51.8,194.9
  pour Bottom: 46.8,209.2 46.8,190.7 77.4,190.7 77.4,209.2
VALVE_GND
  pour Top (rank 5): -1,211 151,211 151,-1 -1,-1
  pour Route2 (rank 5): -1.2,211.2 151.2,211.2 151.2,-1.2 -1.2,-1.2

### Text on the board
Top: RF-OUT-001
tNames: SPI and power | RF-OUT-001 | 12V GND | Relay Control